# EAGLE design hacker-house-esp32-board (EAGLE 9.3.0)

## Sheet 1 of 7
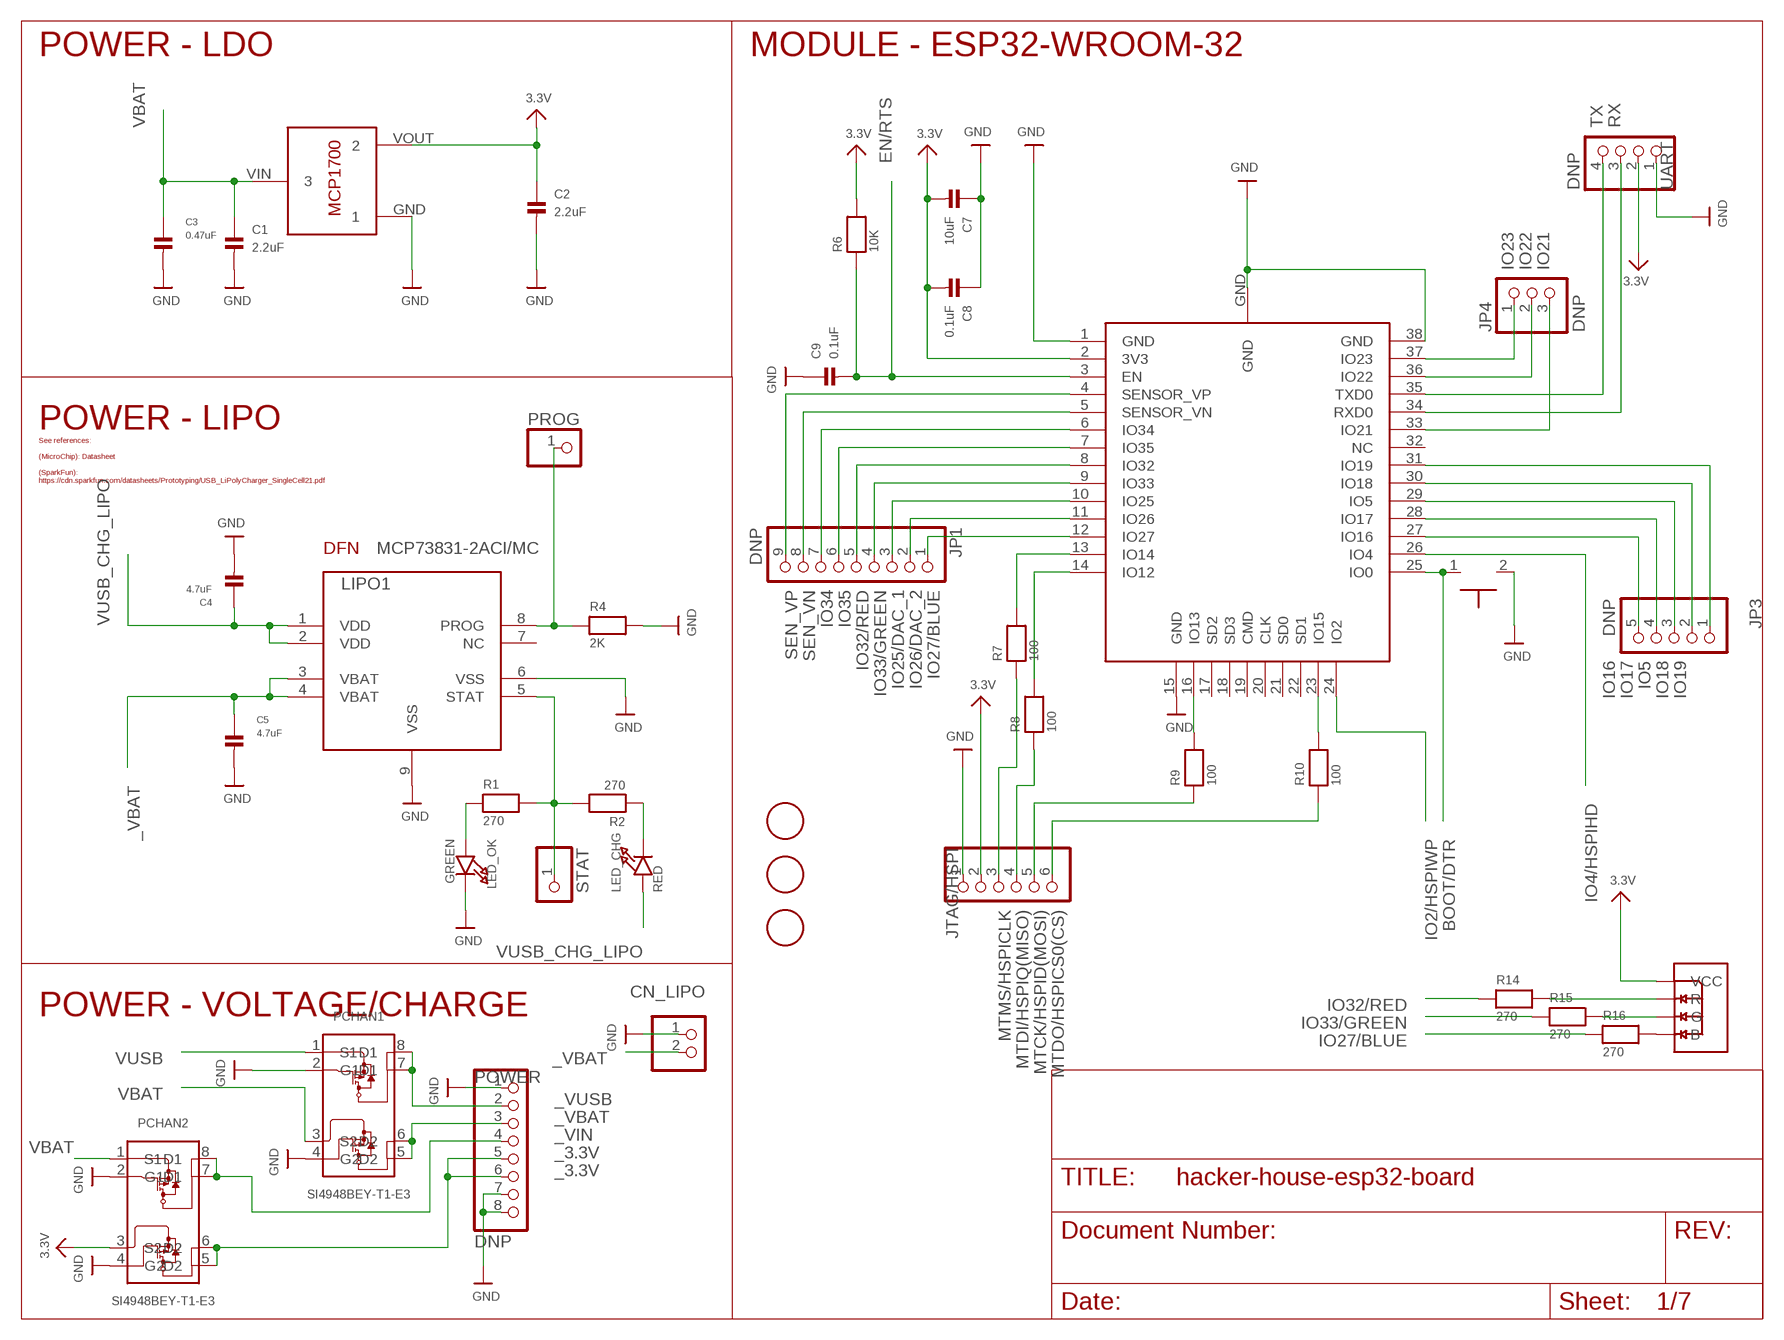
[diagram p0: schematic, sheet 1]

### Parts
BOOT  TACTILE_SWITCH_NO_GND_NO_BOSS  [SIDE_ACT_NO_GND_NO_BOSS]
C1  2.2uF  CAP_CERAMIC_0402MP  [_0402MP]
C2  2.2uF  CAP_CERAMIC_0402MP  [_0402MP]
C3  0.47uF  CAP_CERAMIC_0402MP  [_0402MP]
C4  4.7uF  CAP_CERAMIC_0402MP  [_0402MP]
C5  4.7uF  CAP_CERAMIC_0402MP  [_0402MP]
C7  10uF  CAP_CERAMIC_0603MP  [_0603MP]
C8  0.1uF  CAP_CERAMIC_0402MP  [_0402MP]
C9  0.1uF  CAP_CERAMIC_0402MP  [_0402MP]
CN_LIPO  JST_2PIN  [JSTPH2]
FID1  FIDUCIAL  [FIDUCIAL_1MM]
FID2  FIDUCIAL  [FIDUCIAL_1MM]
FID3  FIDUCIAL  [FIDUCIAL_1MM]
JP1  DNP  PINHD-1X9  [1X09]
JP3  DNP  PINHD-1X5  [1X05]
JP4  DNP  PINHD-1X3  [1X03]
JTAG/HSPI  HEADER-1X6ROUND  [1X06_ROUND]
LDO1  3.3V  MCP1700T-3302E/TT  [MCP1700T-3302E/TT]
LED_CHG  RED  LED0603_NOOUTLINE  [CHIPLED_0603_NOOUTLINE]
LED_OK  GREEN  LED0603_NOOUTLINE  [CHIPLED_0603_NOOUTLINE]
LIPO1  MCP73831-2ACI/MC  [2X3_DFN]
MOD1  ESP32-WROOM-32  [ESP32-WROOM-32-MODULE]
PCHAN1  SI4948BEY-T1-E3  [SO-8]
PCHAN2  SI4948BEY-T1-E3  [SO-8]
POWER  DNP  HEADER-1X8  [1X08_OVAL]
PROG  HEADER-1X1ROUND  [1X01_ROUND]
R1  270  RESISTOR_0402MP  [_0402MP]
R2  270  RESISTOR_0402MP  [_0402MP]
R4  2K  RESISTOR_0402MP  [_0402MP]
R6  10K  RESISTOR_0402MP  [_0402MP]
R7  100  RESISTOR_0402MP  [_0402MP]
R8  100  RESISTOR_0402MP  [_0402MP]
R9  100  RESISTOR_0402MP  [_0402MP]
R10  100  RESISTOR_0402MP  [_0402MP]
R14  270  RESISTOR_0402MP  [_0402MP]
R15  270  RESISTOR_0402MP  [_0402MP]
R16  270  RESISTOR_0402MP  [_0402MP]
RGB1  LRTB_R48G  [LRTB_R48G]
STAT  HEADER-1X1ROUND  [1X01_ROUND]
UART  DNP  HEADER-1X4ROUND  [1X04_ROUND]

### Nets
3.3V: C2.1 C7.2 C8.2 JTAG/HSPI.2 LDO1.VOUT MOD1.2(3V3) PCHAN2.3(S2) R6.2 RGB1.1(VCC) UART.2 ; also sheet 2
_3.3V: PCHAN2.5(D2) PCHAN2.6(D2) POWER.5 POWER.6
_VBAT: C5.1 CN_LIPO.2 LIPO1.3(VBAT) LIPO1.4(VBAT) PCHAN1.5(D2) PCHAN1.6(D2) POWER.3
_VIN: PCHAN2.7(D1) PCHAN2.8(D1) POWER.4
_VUSB: PCHAN1.7(D1) PCHAN1.8(D1) POWER.2 ; also sheet 2
BOOT/DTR: BOOT.1 MOD1.25(IO0) ; also sheet 2
EN/RTS: C9.2 MOD1.3(EN) R6.1 ; also sheet 2
GND_UNMASKED: BOOT.2 C1.2 C2.2 C3.2 C4.2 C5.2 C7.1 C8.1 C9.1 CN_LIPO.1 JTAG/HSPI.1 LDO1.GND LED_OK.C LIPO1.6(VSS) LIPO1.9(VSS) MOD1.1(GND) MOD1.15(GND) MOD1.38(GND) MOD1.GND PCHAN1.2(G1) PCHAN1.4(G2) PCHAN2.2(G1) PCHAN2.4(G2) POWER.1 POWER.7 POWER.8 R4.2 UART.1 ; supply symbol labelled GND ; also sheet 2
IO2/HSPIWP: MOD1.24(IO2)
IO4/HSPIHD: MOD1.26(IO4)
IO5: JP3.3 MOD1.29(IO5)
IO16: JP3.5 MOD1.27(IO16)
IO17: JP3.4 MOD1.28(IO17)
IO18: JP3.2 MOD1.30(IO18)
IO19: JP3.1 MOD1.31(IO19)
IO21: JP4.3 MOD1.33(IO21)
IO22: JP4.2 MOD1.36(IO22)
IO23: JP4.1 MOD1.37(IO23)
IO25/DAC_1: JP1.3 MOD1.10(IO25)
IO26/DAC_2: JP1.2 MOD1.11(IO26)
IO27/BLUE: JP1.1 MOD1.12(IO27) R16.1
IO32/RED: JP1.5 MOD1.8(IO32) R14.1
IO33/GREEN: JP1.4 MOD1.9(IO33) R15.1
IO34: JP1.7 MOD1.6(IO34)
IO35: JP1.6 MOD1.7(IO35)
MTCK/HSPID(MOSI): JTAG/HSPI.5 R9.1
MTDI/HSPIQ(MISO): JTAG/HSPI.4 R8.1
MTDI_: MOD1.14(IO12) R8.2
MTDO/HSPICS0(CS): JTAG/HSPI.6 R10.1
MTMS/HSPICLK: JTAG/HSPI.3 R7.1
N$6: R16.2 RGB1.4(B)
N$7: MOD1.13(IO14) R7.2
N$8: R15.2 RGB1.3(G)
N$9: LED_OK.A R1.1
N$10: LED_CHG.C R2.1
N$11: R14.2 RGB1.2(R)
N$18: MOD1.16(IO13) R9.2
N$19: MOD1.23(IO15) R10.2
PROG: LIPO1.8(PROG) PROG.1 R4.1
RX: MOD1.34(RXD0) UART.3 ; also sheet 2
SEN_VN: JP1.8 MOD1.5(SENSOR_VN)
SEN_VP: JP1.9 MOD1.4(SENSOR_VP)
STAT: LIPO1.5(STAT) R1.2 R2.2 STAT.1
TX: MOD1.35(TXD0) UART.4 ; also sheet 2
VBAT: C1.1 C3.1 LDO1.VIN PCHAN1.3(S2) PCHAN2.1(S1)
VUSB: PCHAN1.1(S1) ; also sheet 2
VUSB_CHG_LIPO: C4.1 LED_CHG.A LIPO1.1(VDD) LIPO1.2(VDD) ; also sheet 2
Unconnected: LIPO1.7(NC) MOD1.17(SD2) MOD1.18(SD3) MOD1.19(CMD) MOD1.20(CLK) MOD1.21(SD0) MOD1.22(SD1) MOD1.32(NC)

### Notes on the sheet
- POWER - LDO | MODULE - ESP32-WROOM-32
- POWER - LIPO
- See references:
  
  (MicroChip): Datasheet
  
  (SparkFun): 
  https://cdn.sparkfun.com/datasheets/Prototyping/USB_LiPolyCharger_SingleCell21.pdf
- POWER - VOLTAGE/CHARGE

## Sheet 2 of 7
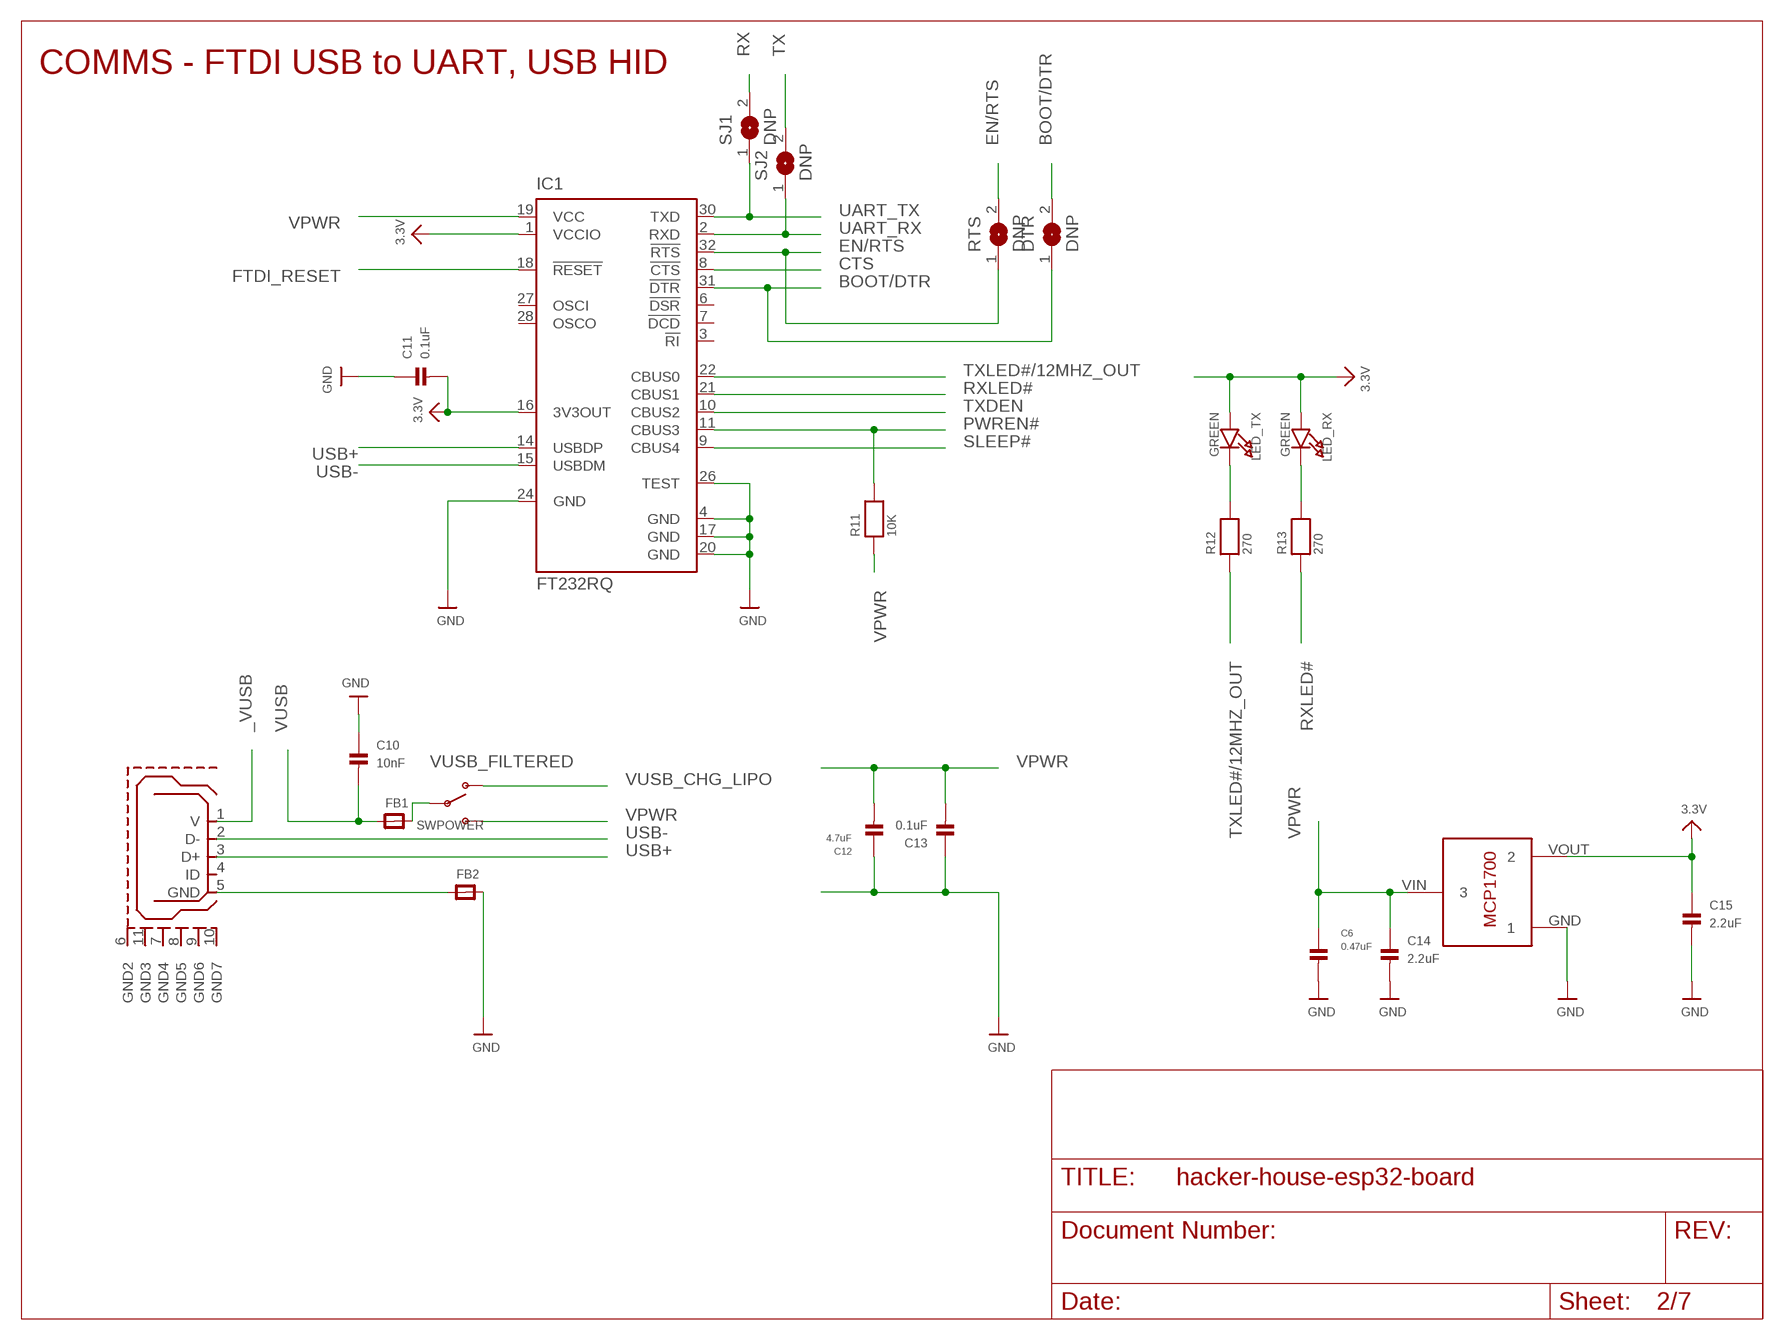
[diagram p1: schematic, sheet 2]

### Parts
C6  0.47uF  CAP_CERAMIC_0402MP  [_0402MP]
C10  10nF  CAP_CERAMIC_0402MP  [_0402MP]
C11  0.1uF  CAP_CERAMIC_0402MP  [_0402MP]
C12  4.7uF  CAP_CERAMIC_0402MP  [_0402MP]
C13  0.1uF  CAP_CERAMIC_0402MP  [_0402MP]
C14  2.2uF  CAP_CERAMIC_0402MP  [_0402MP]
C15  2.2uF  CAP_CERAMIC_0402MP  [_0402MP]
DTR  DNP  SOLDERJUMPERCLOSED  [SOLDERJUMPER_CLOSEDWIRE]
FB1  FERRITE_0603MP  [_0603MP]
FB2  FERRITE_0603MP  [_0603MP]
IC1  FT232RQ  [QFN32]
LDO2  3.3V  MCP1700T-3302E/TT  [MCP1700T-3302E/TT]
LED_RX  GREEN  LED0603_NOOUTLINE  [CHIPLED_0603_NOOUTLINE]
LED_TX  GREEN  LED0603_NOOUTLINE  [CHIPLED_0603_NOOUTLINE]
R11  10K  RESISTOR_0402MP  [_0402MP]
R12  270  RESISTOR_0402MP  [_0402MP]
R13  270  RESISTOR_0402MP  [_0402MP]
RTS  DNP  SOLDERJUMPERCLOSED  [SOLDERJUMPER_CLOSEDWIRE]
SJ1  DNP  SOLDERJUMPERCLOSED  [SOLDERJUMPER_CLOSEDWIRE]
SJ2  DNP  SOLDERJUMPERCLOSED  [SOLDERJUMPER_CLOSEDWIRE]
SWPOWER  SWITCH_SPDT  [SPDT_SMT_SSSS811101]
U$14  USB_MICROB  [USB_MICROB_PACKAGE]

### Nets
3.3V: C11.2 C15.1 IC1.1(VCCIO) IC1.16(3V3OUT) LDO2.VOUT LED_RX.A LED_TX.A ; also sheet 1
_VUSB: U$14.1(V) ; also sheet 1
BOOT/DTR: DTR.1 DTR.2 IC1.31(!DTR) ; also sheet 1
CTS: IC1.8(!CTS)
EN/RTS: IC1.32(!RTS) RTS.1 RTS.2 ; also sheet 1
FTDI_RESET: IC1.18(!RESET)
GND_UNMASKED: C6.2 C10.1 C11.1 C12.1 C13.1 C14.2 C15.2 FB2.2 IC1.4(GND) IC1.17(GND) IC1.20(GND) IC1.24(GND) IC1.26(TEST) LDO2.GND ; supply symbol labelled GND ; also sheet 1
N$2: FB2.1 U$14.5(GND)
N$4: LED_TX.C R12.2
N$5: LED_RX.C R13.2
PWREN#: IC1.11(CBUS3) R11.2
RX: SJ1.2 ; also sheet 1
RXLED#: IC1.21(CBUS1) R13.1
SLEEP#: IC1.9(CBUS4)
TX: SJ2.2 ; also sheet 1
TXDEN: IC1.10(CBUS2)
TXLED#/12MHZ_OUT: IC1.22(CBUS0) R12.1
UART_RX: IC1.2(RXD) SJ2.1
UART_TX: IC1.30(TXD) SJ1.1
USB+: IC1.14(USBDP) U$14.3(D+)
USB-: IC1.15(USBDM) U$14.2(D-)
VPWR: C6.1 C12.2 C13.2 C14.1 IC1.19(VCC) LDO2.VIN R11.1 SWPOWER.C(S)
VUSB: C10.2 FB1.1 ; also sheet 1
VUSB_CHG_LIPO: SWPOWER.A(O) ; also sheet 1
VUSB_FILTERED: FB1.2 SWPOWER.B(P)
Unconnected: IC1.3(!RI) IC1.6(!DSR) IC1.7(!DCD) IC1.27(OSCI) IC1.28(OSCO) U$14.4(ID) U$14.6(GND2) U$14.7(GND4) U$14.8(GND5) U$14.9(GND6) U$14.10(GND7) U$14.11(GND3)

### Notes on the sheet
- COMMS - FTDI USB to UART, USB HID

## Sheet 3 of 7
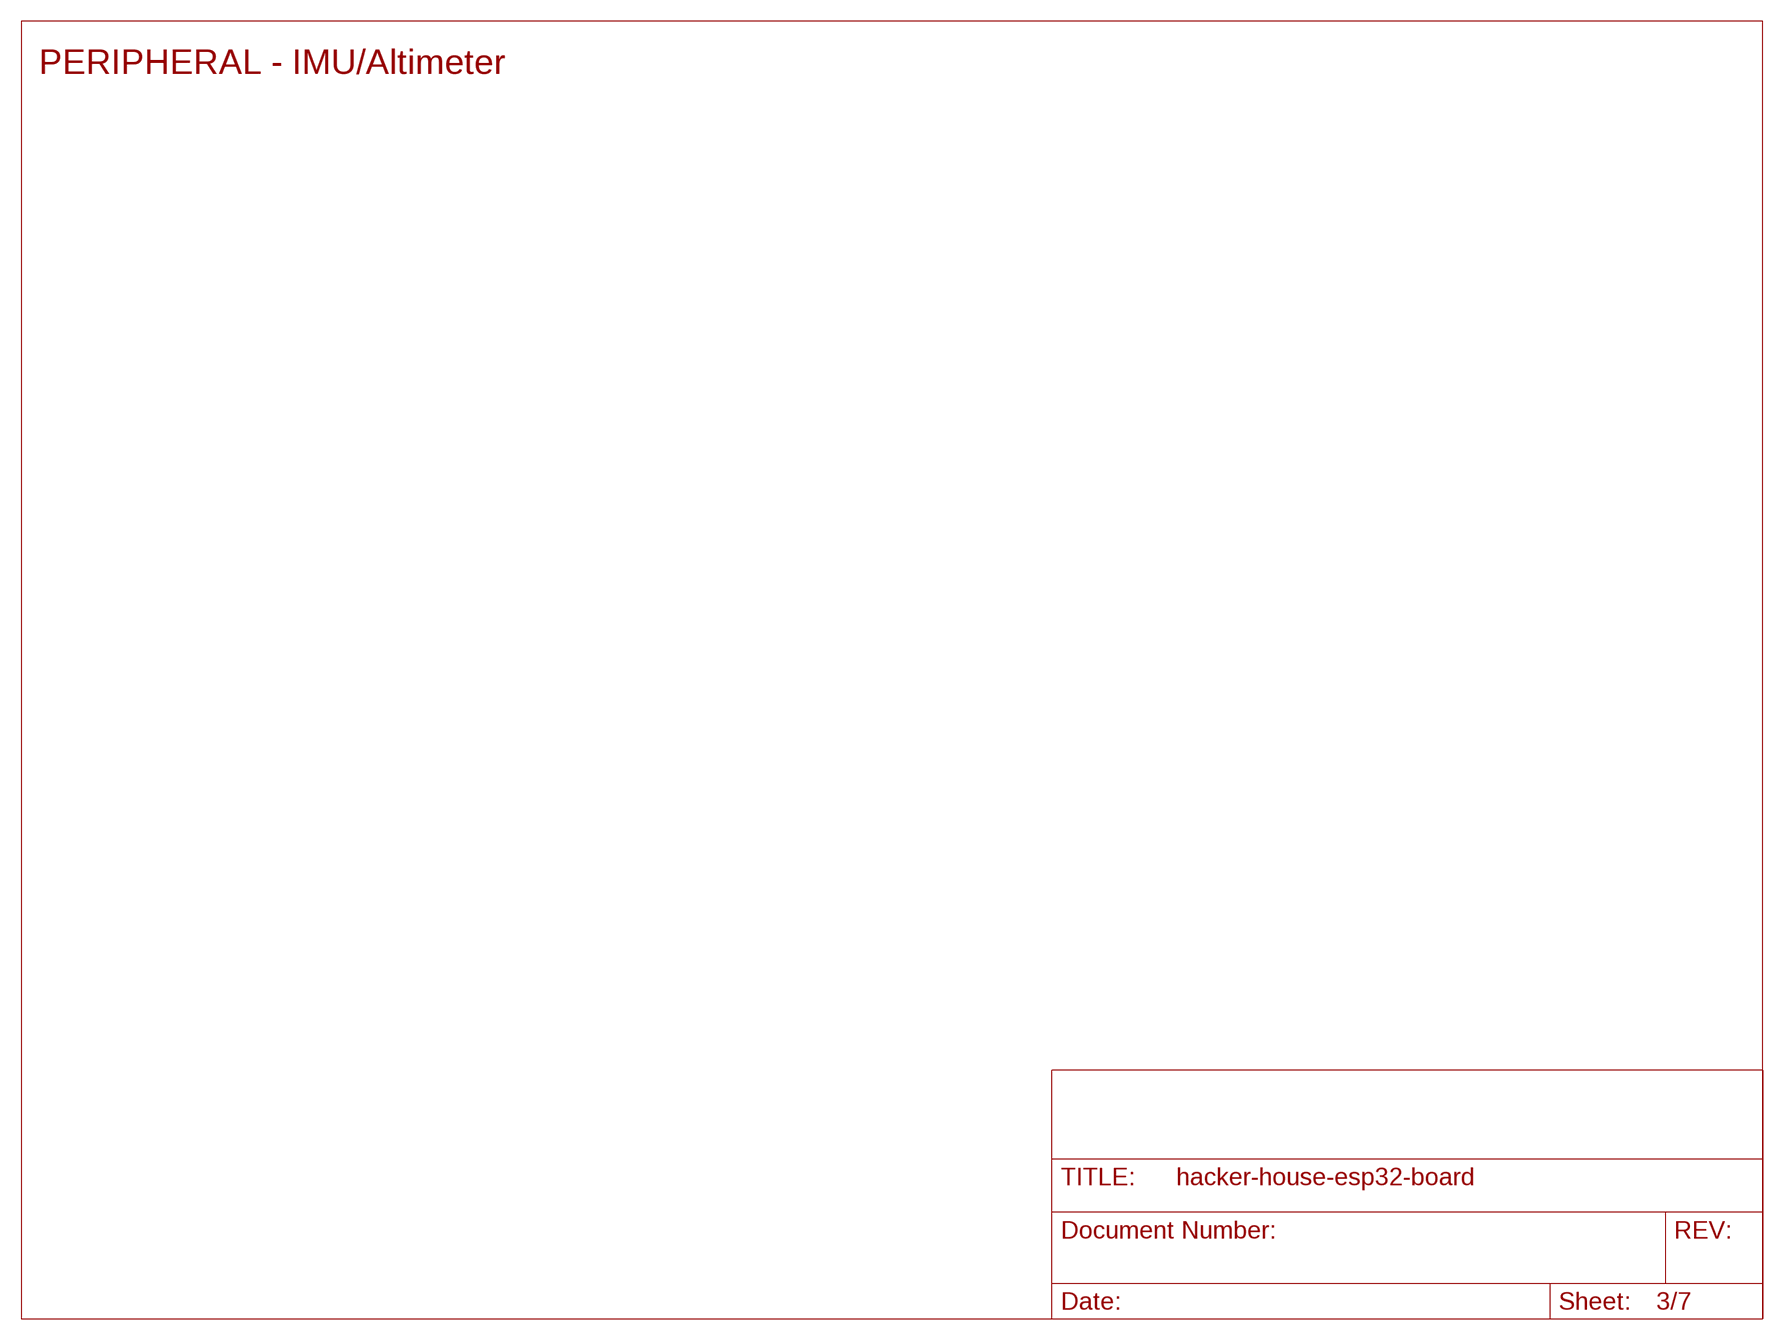
[diagram p2: schematic, sheet 3]

### Notes on the sheet
- PERIPHERAL - IMU/Altimeter

## Sheet 4 of 7
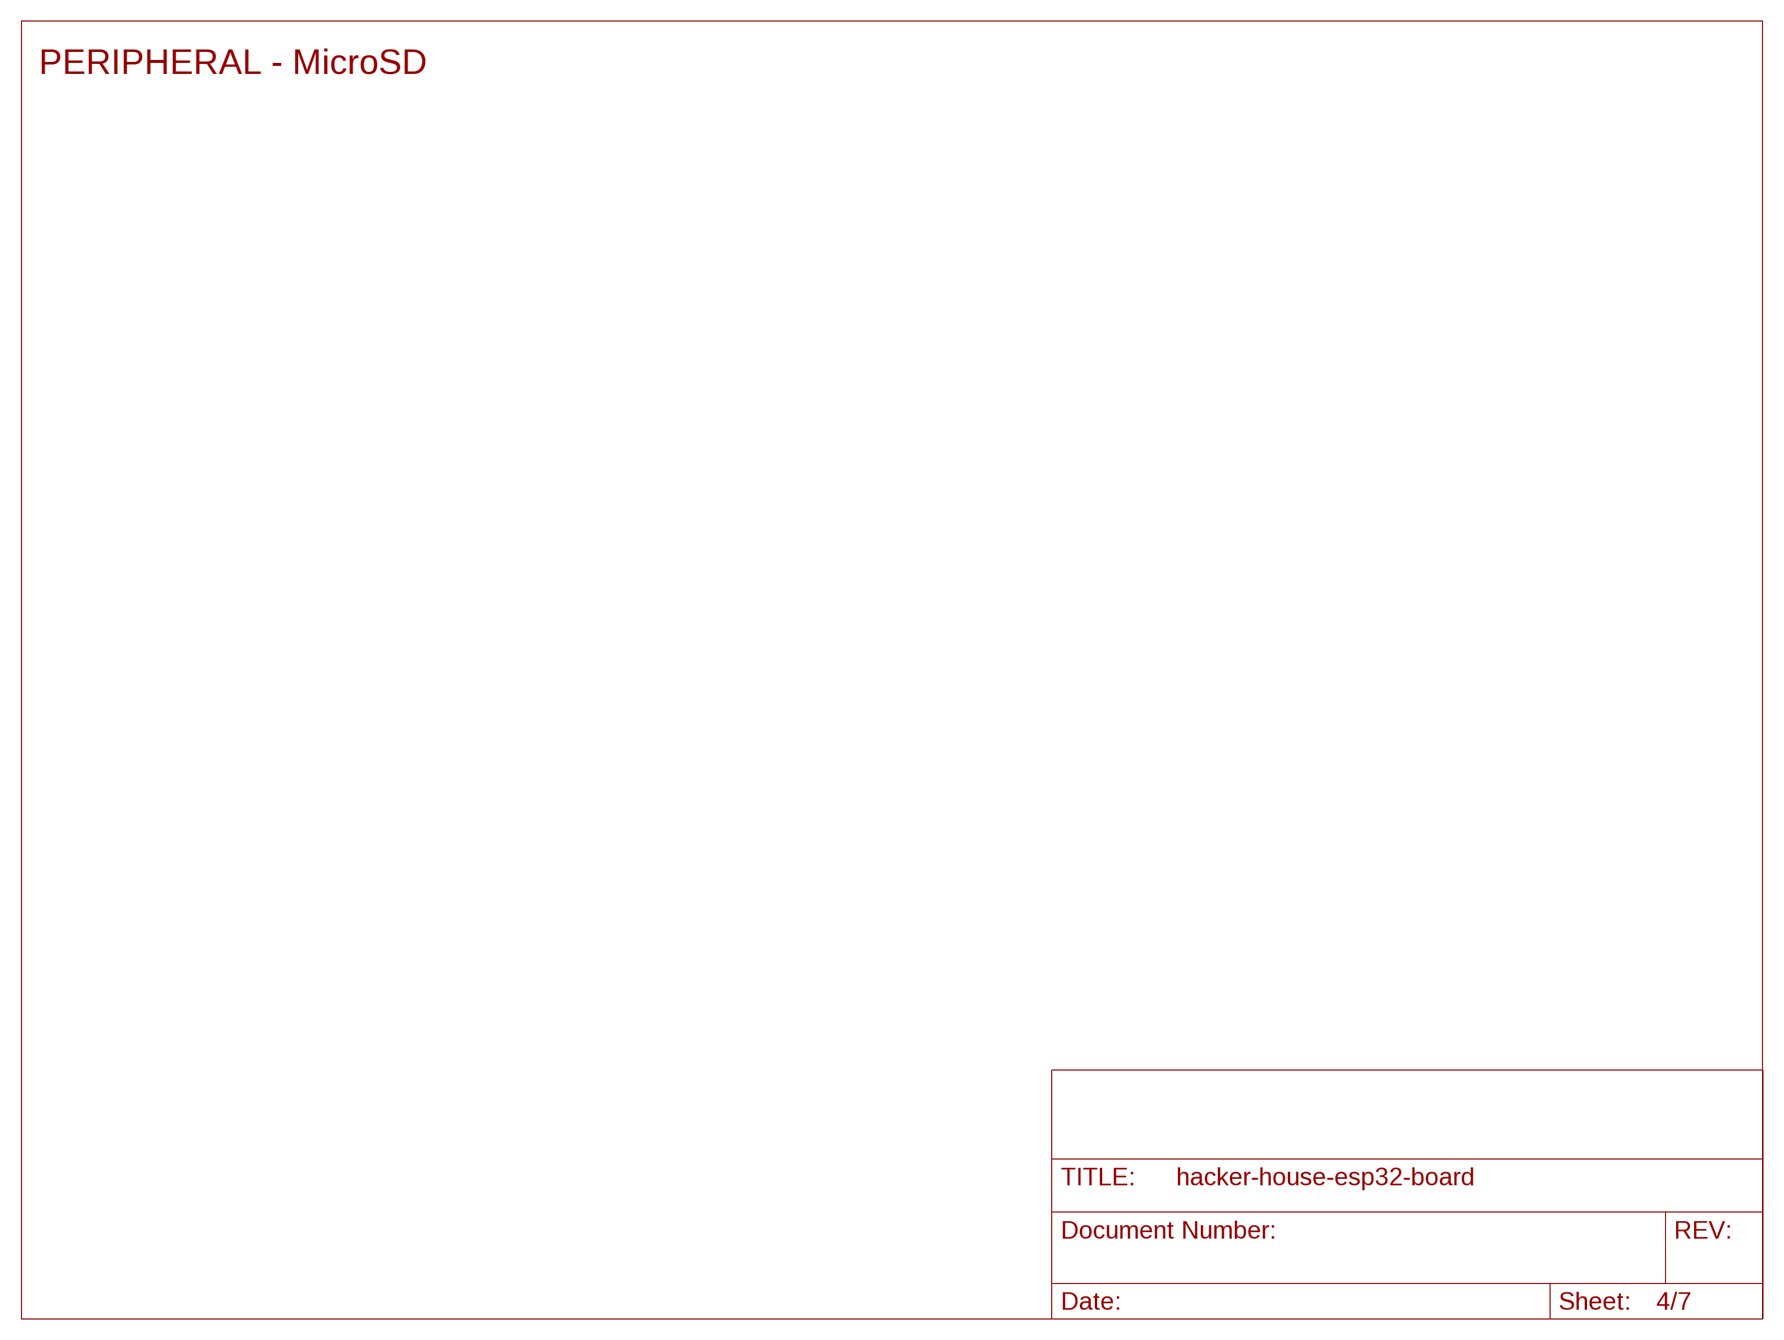
[diagram p3: schematic, sheet 4]

### Notes on the sheet
- PERIPHERAL - MicroSD

## Sheet 5 of 7
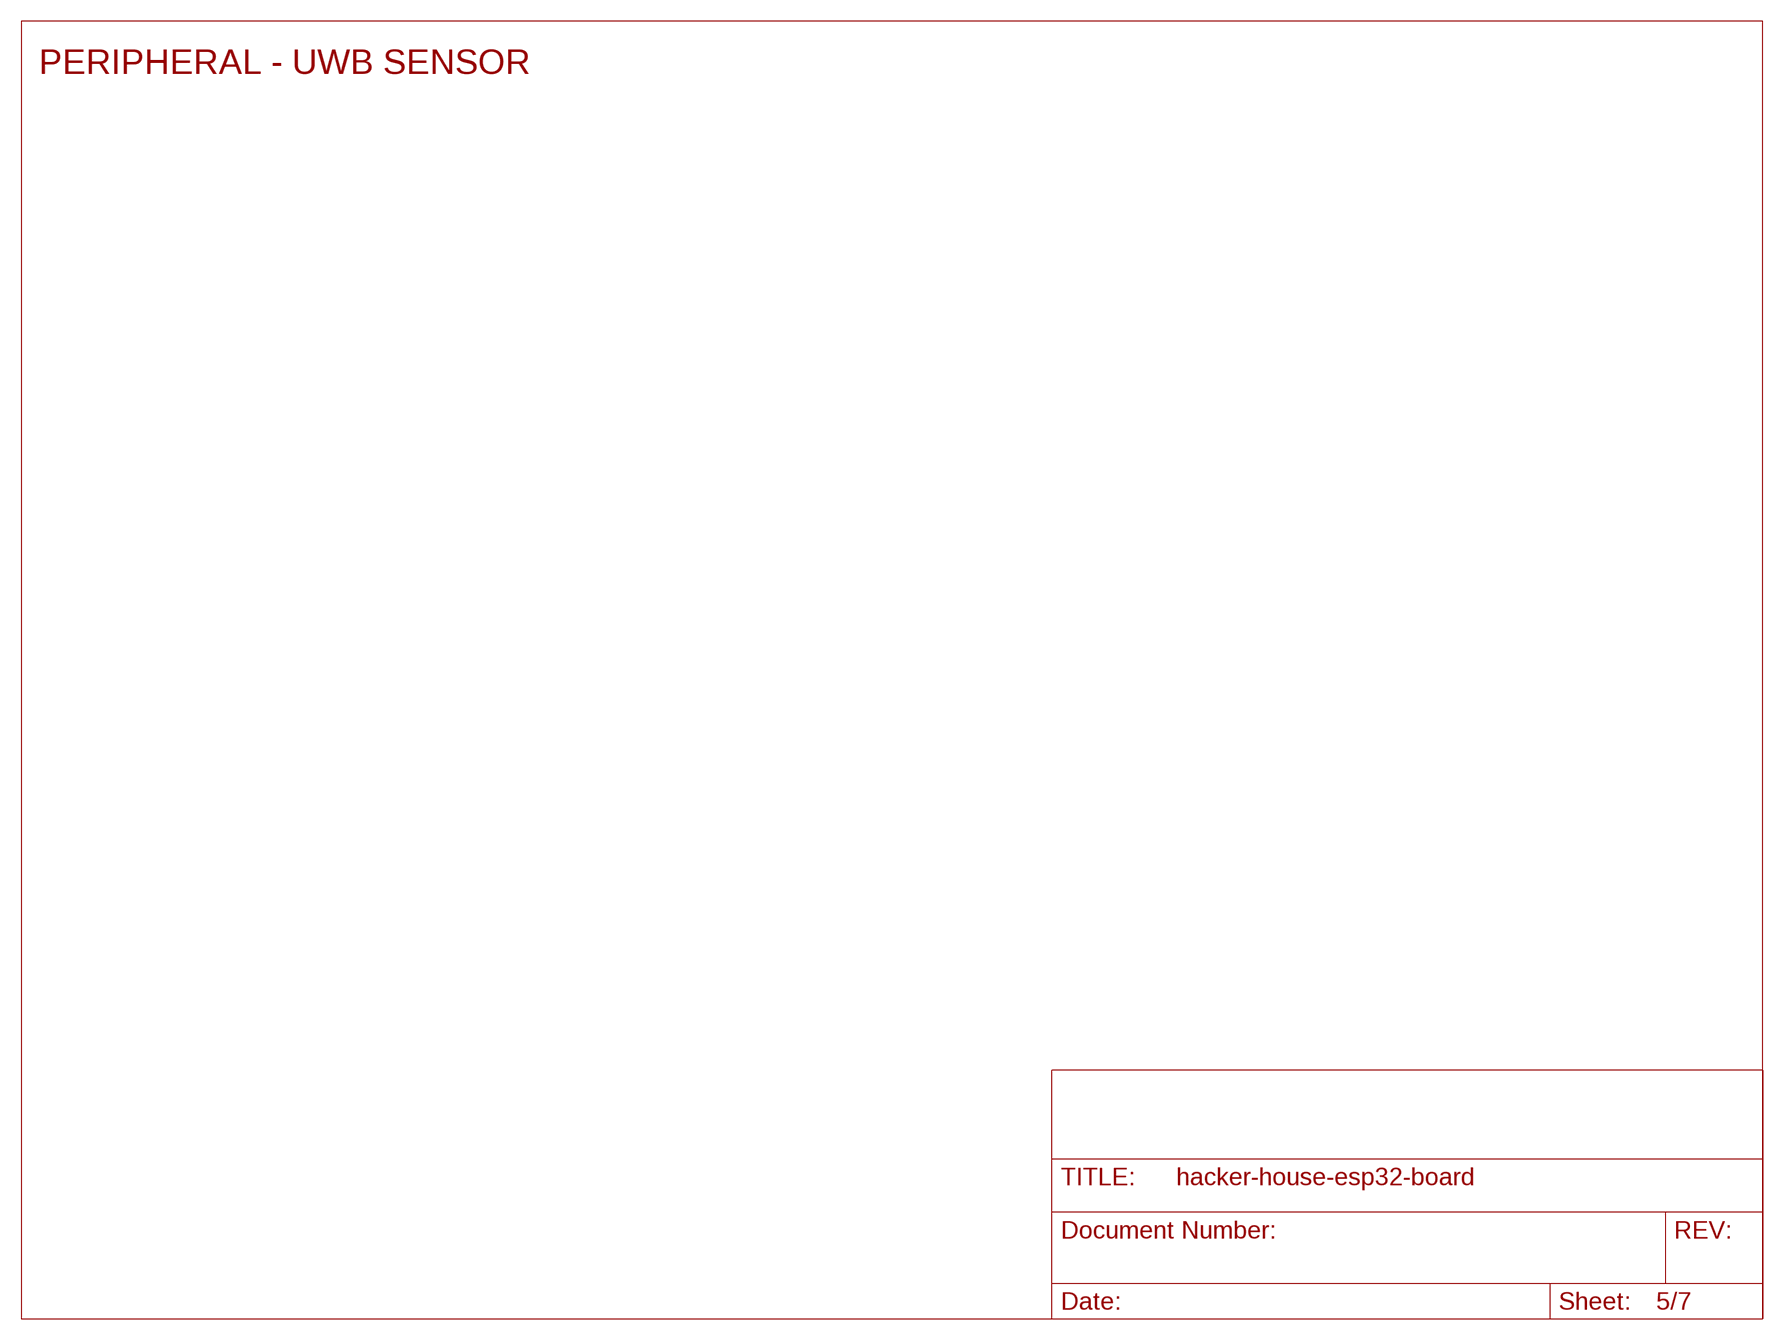
[diagram p4: schematic, sheet 5]

### Notes on the sheet
- PERIPHERAL - UWB SENSOR

## Sheet 6 of 7
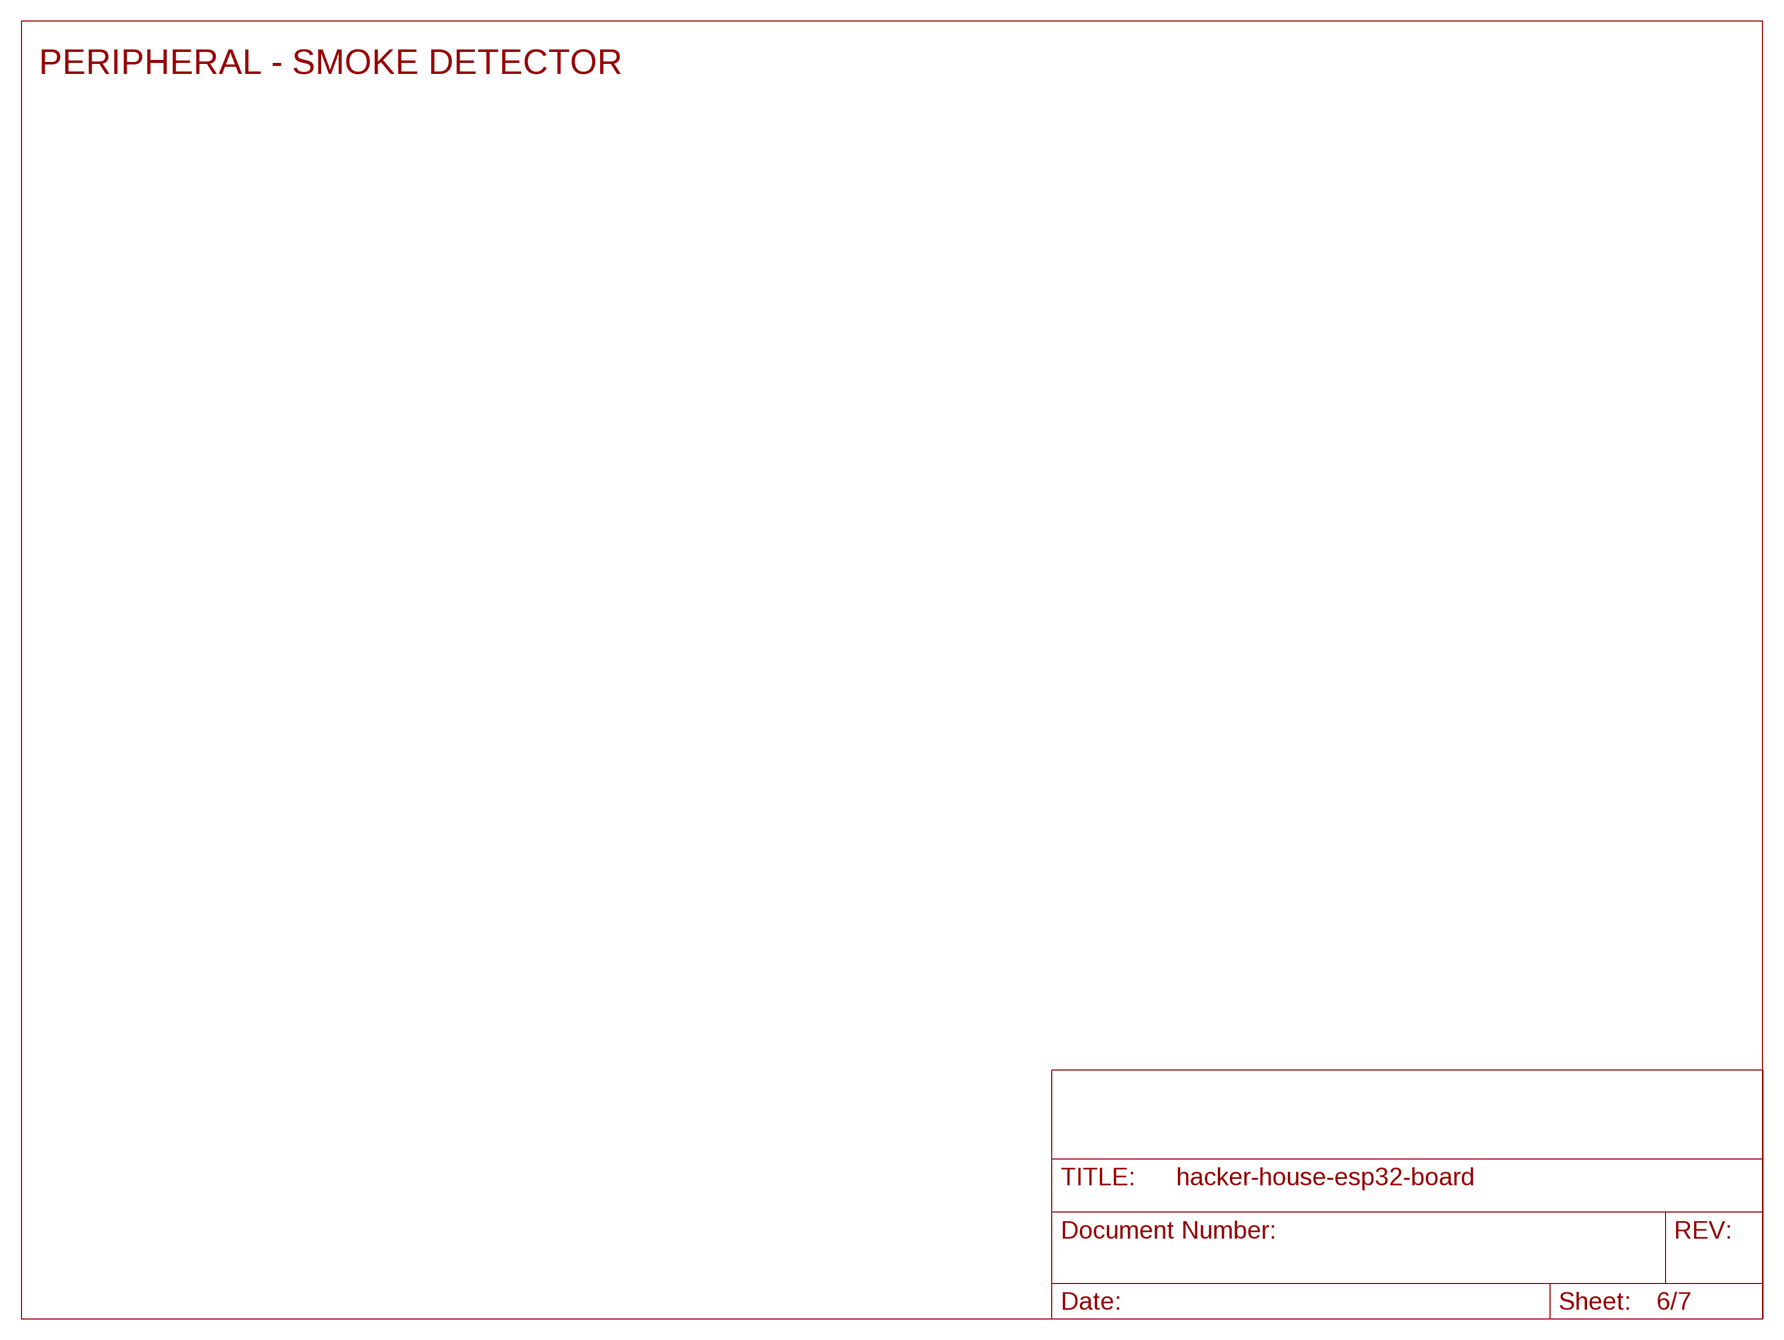
[diagram p5: schematic, sheet 6]

### Notes on the sheet
- PERIPHERAL - SMOKE DETECTOR

## Sheet 7 of 7
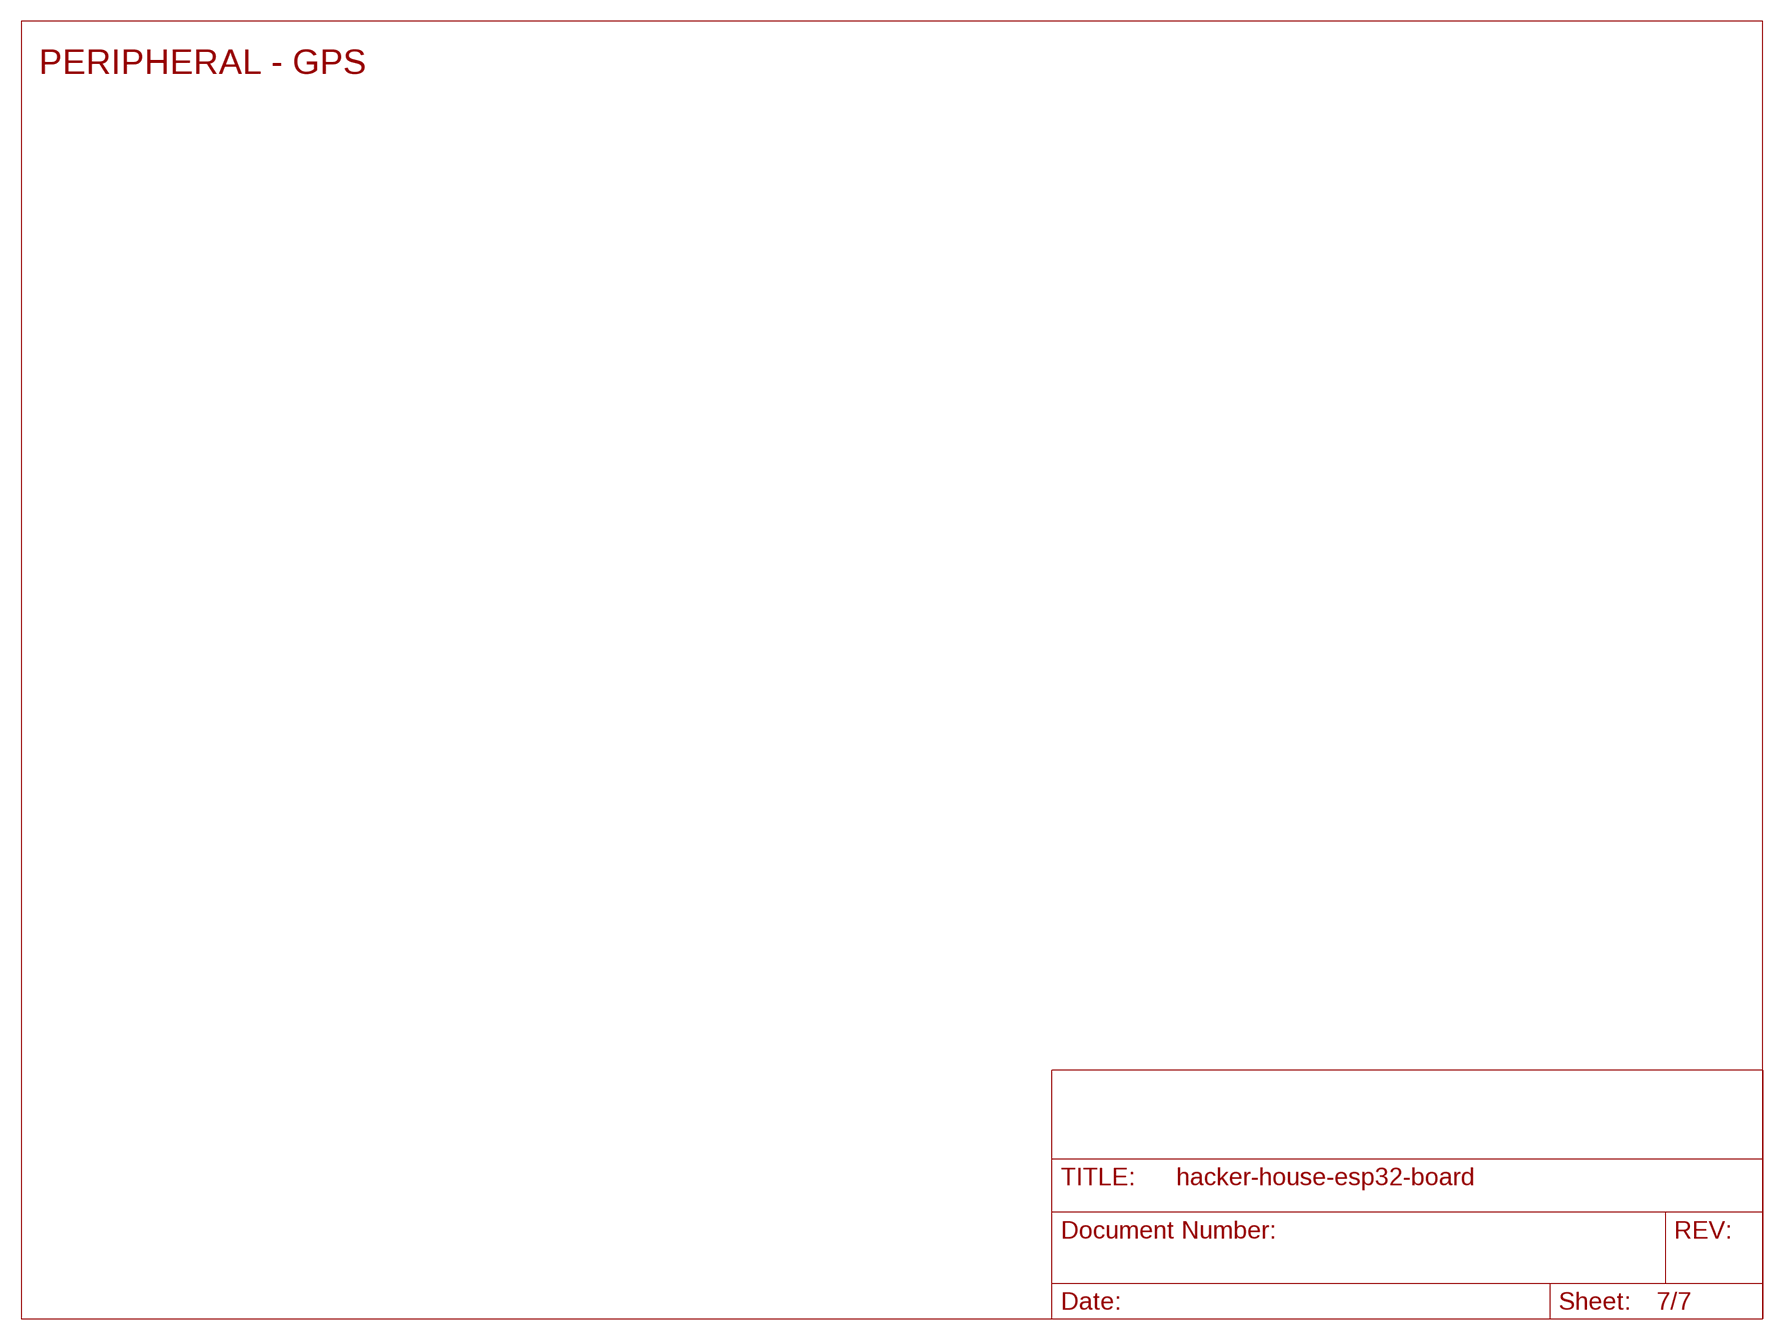
[diagram p6: schematic, sheet 7]

### Notes on the sheet
- PERIPHERAL - GPS

## Library data of the parts
BOOT = omron_tactile_switch:TACTILE_SWITCH_NO_GND_NO_BOSS: Omron tactile switch; MPN: B3U-3000P
C1 C2 C14 C15 = microbuilder:CAP_CERAMIC: Ceramic Capacitors 0402 - 0402 Surface Mount Capacitors 16pF 50V 5% [Digikey: 445-4899-2-ND] 18pF 50V 5% [Digikey: 490-1281-2-ND] 22pF 50V 5% [Digikey: 490-1283-2-ND] 68pF 50V 5% [Digikey: 490-1289-2-ND] 0.1uF 10V 10% [Digikey: 490-1318-2-ND] 1.0uF 6.3V 10% [Digikey: 490-1320-2-ND] 0603 - 0603 Surface Mount Capacitors 16 pF 50V 5% [Digikey: 445-5051-2-ND] 22 pF 50V [Digikey: PCC220ACVTR-ND] 33 pF 50V 5% [Digikey: 490-1415-1-ND] 56pF 50V 5% [Digikey: 490-1421-1-ND] 220pF 50V 5% [Digikey: 445-1285-1-ND] 680 pF 50V 2200 pF 50V 5% C0G [Digikey: 445-1297-1-ND] 5600 pF 100V 5% X7R [Digikey: 478-3711-1-ND] 0.1 µF 25V 10% [Digikey: PCC2277TR-ND] 0.22 µF 16V 10% X7R [Digikey: 445-1318-1-ND] 1.0 µF 25V 10% [Digikey: 445-5146-2-ND] 0603 - RF Specific 3pF 250V +/-0.1pF RF [Digikey: 712-1347-1-ND] 18 pF 250V 5% [Digikey: 478-3505-1-ND or 712-1322-1-ND] 56 pF 250V 5% C0G RF [Digikey: 490-4867-1-ND] 68 pF 250V RF [Digikey: 490-4868-1-ND] 0805 - 0805 Surface Mount Capacitors 220 pF 250V 2% RF Ceramic Capacitor [Digikey: 712-1398-1-ND] 1000 pF 50V 2% NP0 Ceramic Capacitor [Digikey: 478-3760-1-ND] 0.1 µF 25V 10% Ceramic Capacitor [Digikey: PCC1828TR-ND] 1.0 µF 16V 10% Ceramic Capacitor[Digikey: 490-1691-2-ND] 10.0 µF 10V 10% Ceramic Capacitor[Digikey: 709-1228-1-ND] 10.0 uF 16V 10% Ceramic Capacitor [Digikey: 478-5165-2-ND] 47 uF 6.3V 20% Ceramic Capacitor [Digikey: 587-1779-1-ND or 399-5506-1-ND] 1206 - 1206 Surface Mount Capacitors 47uF 10V 20% Ceramic Capacitor [Digikey: 490-5528-1-ND or 399-5508-1-ND or 445-6010-1-ND] 100uF 6.3V -20%, +80% Y5V Ceramic Capacitor (Digikey: 490-4512-1-ND, Mouser: 81-GRM31CF50J107ZE1L); MPN: C1005X5R0J225K050BC
C3 C6 = microbuilder:CAP_CERAMIC: Ceramic Capacitors 0402 - 0402 Surface Mount Capacitors 16pF 50V 5% [Digikey: 445-4899-2-ND] 18pF 50V 5% [Digikey: 490-1281-2-ND] 22pF 50V 5% [Digikey: 490-1283-2-ND] 68pF 50V 5% [Digikey: 490-1289-2-ND] 0.1uF 10V 10% [Digikey: 490-1318-2-ND] 1.0uF 6.3V 10% [Digikey: 490-1320-2-ND] 0603 - 0603 Surface Mount Capacitors 16 pF 50V 5% [Digikey: 445-5051-2-ND] 22 pF 50V [Digikey: PCC220ACVTR-ND] 33 pF 50V 5% [Digikey: 490-1415-1-ND] 56pF 50V 5% [Digikey: 490-1421-1-ND] 220pF 50V 5% [Digikey: 445-1285-1-ND] 680 pF 50V 2200 pF 50V 5% C0G [Digikey: 445-1297-1-ND] 5600 pF 100V 5% X7R [Digikey: 478-3711-1-ND] 0.1 µF 25V 10% [Digikey: PCC2277TR-ND] 0.22 µF 16V 10% X7R [Digikey: 445-1318-1-ND] 1.0 µF 25V 10% [Digikey: 445-5146-2-ND] 0603 - RF Specific 3pF 250V +/-0.1pF RF [Digikey: 712-1347-1-ND] 18 pF 250V 5% [Digikey: 478-3505-1-ND or 712-1322-1-ND] 56 pF 250V 5% C0G RF [Digikey: 490-4867-1-ND] 68 pF 250V RF [Digikey: 490-4868-1-ND] 0805 - 0805 Surface Mount Capacitors 220 pF 250V 2% RF Ceramic Capacitor [Digikey: 712-1398-1-ND] 1000 pF 50V 2% NP0 Ceramic Capacitor [Digikey: 478-3760-1-ND] 0.1 µF 25V 10% Ceramic Capacitor [Digikey: PCC1828TR-ND] 1.0 µF 16V 10% Ceramic Capacitor[Digikey: 490-1691-2-ND] 10.0 µF 10V 10% Ceramic Capacitor[Digikey: 709-1228-1-ND] 10.0 uF 16V 10% Ceramic Capacitor [Digikey: 478-5165-2-ND] 47 uF 6.3V 20% Ceramic Capacitor [Digikey: 587-1779-1-ND or 399-5506-1-ND] 1206 - 1206 Surface Mount Capacitors 47uF 10V 20% Ceramic Capacitor [Digikey: 490-5528-1-ND or 399-5508-1-ND or 445-6010-1-ND] 100uF 6.3V -20%, +80% Y5V Ceramic Capacitor (Digikey: 490-4512-1-ND, Mouser: 81-GRM31CF50J107ZE1L); MPN: GRM155R60J474KE19D
C4 C5 C12 = microbuilder:CAP_CERAMIC: Ceramic Capacitors 0402 - 0402 Surface Mount Capacitors 16pF 50V 5% [Digikey: 445-4899-2-ND] 18pF 50V 5% [Digikey: 490-1281-2-ND] 22pF 50V 5% [Digikey: 490-1283-2-ND] 68pF 50V 5% [Digikey: 490-1289-2-ND] 0.1uF 10V 10% [Digikey: 490-1318-2-ND] 1.0uF 6.3V 10% [Digikey: 490-1320-2-ND] 0603 - 0603 Surface Mount Capacitors 16 pF 50V 5% [Digikey: 445-5051-2-ND] 22 pF 50V [Digikey: PCC220ACVTR-ND] 33 pF 50V 5% [Digikey: 490-1415-1-ND] 56pF 50V 5% [Digikey: 490-1421-1-ND] 220pF 50V 5% [Digikey: 445-1285-1-ND] 680 pF 50V 2200 pF 50V 5% C0G [Digikey: 445-1297-1-ND] 5600 pF 100V 5% X7R [Digikey: 478-3711-1-ND] 0.1 µF 25V 10% [Digikey: PCC2277TR-ND] 0.22 µF 16V 10% X7R [Digikey: 445-1318-1-ND] 1.0 µF 25V 10% [Digikey: 445-5146-2-ND] 0603 - RF Specific 3pF 250V +/-0.1pF RF [Digikey: 712-1347-1-ND] 18 pF 250V 5% [Digikey: 478-3505-1-ND or 712-1322-1-ND] 56 pF 250V 5% C0G RF [Digikey: 490-4867-1-ND] 68 pF 250V RF [Digikey: 490-4868-1-ND] 0805 - 0805 Surface Mount Capacitors 220 pF 250V 2% RF Ceramic Capacitor [Digikey: 712-1398-1-ND] 1000 pF 50V 2% NP0 Ceramic Capacitor [Digikey: 478-3760-1-ND] 0.1 µF 25V 10% Ceramic Capacitor [Digikey: PCC1828TR-ND] 1.0 µF 16V 10% Ceramic Capacitor[Digikey: 490-1691-2-ND] 10.0 µF 10V 10% Ceramic Capacitor[Digikey: 709-1228-1-ND] 10.0 uF 16V 10% Ceramic Capacitor [Digikey: 478-5165-2-ND] 47 uF 6.3V 20% Ceramic Capacitor [Digikey: 587-1779-1-ND or 399-5506-1-ND] 1206 - 1206 Surface Mount Capacitors 47uF 10V 20% Ceramic Capacitor [Digikey: 490-5528-1-ND or 399-5508-1-ND or 445-6010-1-ND] 100uF 6.3V -20%, +80% Y5V Ceramic Capacitor (Digikey: 490-4512-1-ND, Mouser: 81-GRM31CF50J107ZE1L); MPN: GRM155R60G475ME47D
C7 = microbuilder:CAP_CERAMIC: Ceramic Capacitors 0402 - 0402 Surface Mount Capacitors 16pF 50V 5% [Digikey: 445-4899-2-ND] 18pF 50V 5% [Digikey: 490-1281-2-ND] 22pF 50V 5% [Digikey: 490-1283-2-ND] 68pF 50V 5% [Digikey: 490-1289-2-ND] 0.1uF 10V 10% [Digikey: 490-1318-2-ND] 1.0uF 6.3V 10% [Digikey: 490-1320-2-ND] 0603 - 0603 Surface Mount Capacitors 16 pF 50V 5% [Digikey: 445-5051-2-ND] 22 pF 50V [Digikey: PCC220ACVTR-ND] 33 pF 50V 5% [Digikey: 490-1415-1-ND] 56pF 50V 5% [Digikey: 490-1421-1-ND] 220pF 50V 5% [Digikey: 445-1285-1-ND] 680 pF 50V 2200 pF 50V 5% C0G [Digikey: 445-1297-1-ND] 5600 pF 100V 5% X7R [Digikey: 478-3711-1-ND] 0.1 µF 25V 10% [Digikey: PCC2277TR-ND] 0.22 µF 16V 10% X7R [Digikey: 445-1318-1-ND] 1.0 µF 25V 10% [Digikey: 445-5146-2-ND] 0603 - RF Specific 3pF 250V +/-0.1pF RF [Digikey: 712-1347-1-ND] 18 pF 250V 5% [Digikey: 478-3505-1-ND or 712-1322-1-ND] 56 pF 250V 5% C0G RF [Digikey: 490-4867-1-ND] 68 pF 250V RF [Digikey: 490-4868-1-ND] 0805 - 0805 Surface Mount Capacitors 220 pF 250V 2% RF Ceramic Capacitor [Digikey: 712-1398-1-ND] 1000 pF 50V 2% NP0 Ceramic Capacitor [Digikey: 478-3760-1-ND] 0.1 µF 25V 10% Ceramic Capacitor [Digikey: PCC1828TR-ND] 1.0 µF 16V 10% Ceramic Capacitor[Digikey: 490-1691-2-ND] 10.0 µF 10V 10% Ceramic Capacitor[Digikey: 709-1228-1-ND] 10.0 uF 16V 10% Ceramic Capacitor [Digikey: 478-5165-2-ND] 47 uF 6.3V 20% Ceramic Capacitor [Digikey: 587-1779-1-ND or 399-5506-1-ND] 1206 - 1206 Surface Mount Capacitors 47uF 10V 20% Ceramic Capacitor [Digikey: 490-5528-1-ND or 399-5508-1-ND or 445-6010-1-ND] 100uF 6.3V -20%, +80% Y5V Ceramic Capacitor (Digikey: 490-4512-1-ND, Mouser: 81-GRM31CF50J107ZE1L); MPN: C1608X5R1A106K080AC
C8 C9 C11 C13 = microbuilder:CAP_CERAMIC: Ceramic Capacitors 0402 - 0402 Surface Mount Capacitors 16pF 50V 5% [Digikey: 445-4899-2-ND] 18pF 50V 5% [Digikey: 490-1281-2-ND] 22pF 50V 5% [Digikey: 490-1283-2-ND] 68pF 50V 5% [Digikey: 490-1289-2-ND] 0.1uF 10V 10% [Digikey: 490-1318-2-ND] 1.0uF 6.3V 10% [Digikey: 490-1320-2-ND] 0603 - 0603 Surface Mount Capacitors 16 pF 50V 5% [Digikey: 445-5051-2-ND] 22 pF 50V [Digikey: PCC220ACVTR-ND] 33 pF 50V 5% [Digikey: 490-1415-1-ND] 56pF 50V 5% [Digikey: 490-1421-1-ND] 220pF 50V 5% [Digikey: 445-1285-1-ND] 680 pF 50V 2200 pF 50V 5% C0G [Digikey: 445-1297-1-ND] 5600 pF 100V 5% X7R [Digikey: 478-3711-1-ND] 0.1 µF 25V 10% [Digikey: PCC2277TR-ND] 0.22 µF 16V 10% X7R [Digikey: 445-1318-1-ND] 1.0 µF 25V 10% [Digikey: 445-5146-2-ND] 0603 - RF Specific 3pF 250V +/-0.1pF RF [Digikey: 712-1347-1-ND] 18 pF 250V 5% [Digikey: 478-3505-1-ND or 712-1322-1-ND] 56 pF 250V 5% C0G RF [Digikey: 490-4867-1-ND] 68 pF 250V RF [Digikey: 490-4868-1-ND] 0805 - 0805 Surface Mount Capacitors 220 pF 250V 2% RF Ceramic Capacitor [Digikey: 712-1398-1-ND] 1000 pF 50V 2% NP0 Ceramic Capacitor [Digikey: 478-3760-1-ND] 0.1 µF 25V 10% Ceramic Capacitor [Digikey: PCC1828TR-ND] 1.0 µF 16V 10% Ceramic Capacitor[Digikey: 490-1691-2-ND] 10.0 µF 10V 10% Ceramic Capacitor[Digikey: 709-1228-1-ND] 10.0 uF 16V 10% Ceramic Capacitor [Digikey: 478-5165-2-ND] 47 uF 6.3V 20% Ceramic Capacitor [Digikey: 587-1779-1-ND or 399-5506-1-ND] 1206 - 1206 Surface Mount Capacitors 47uF 10V 20% Ceramic Capacitor [Digikey: 490-5528-1-ND or 399-5508-1-ND or 445-6010-1-ND] 100uF 6.3V -20%, +80% Y5V Ceramic Capacitor (Digikey: 490-4512-1-ND, Mouser: 81-GRM31CF50J107ZE1L); MPN: CC0402KRX7R6BB104
C10 = microbuilder:CAP_CERAMIC: Ceramic Capacitors 0402 - 0402 Surface Mount Capacitors 16pF 50V 5% [Digikey: 445-4899-2-ND] 18pF 50V 5% [Digikey: 490-1281-2-ND] 22pF 50V 5% [Digikey: 490-1283-2-ND] 68pF 50V 5% [Digikey: 490-1289-2-ND] 0.1uF 10V 10% [Digikey: 490-1318-2-ND] 1.0uF 6.3V 10% [Digikey: 490-1320-2-ND] 0603 - 0603 Surface Mount Capacitors 16 pF 50V 5% [Digikey: 445-5051-2-ND] 22 pF 50V [Digikey: PCC220ACVTR-ND] 33 pF 50V 5% [Digikey: 490-1415-1-ND] 56pF 50V 5% [Digikey: 490-1421-1-ND] 220pF 50V 5% [Digikey: 445-1285-1-ND] 680 pF 50V 2200 pF 50V 5% C0G [Digikey: 445-1297-1-ND] 5600 pF 100V 5% X7R [Digikey: 478-3711-1-ND] 0.1 µF 25V 10% [Digikey: PCC2277TR-ND] 0.22 µF 16V 10% X7R [Digikey: 445-1318-1-ND] 1.0 µF 25V 10% [Digikey: 445-5146-2-ND] 0603 - RF Specific 3pF 250V +/-0.1pF RF [Digikey: 712-1347-1-ND] 18 pF 250V 5% [Digikey: 478-3505-1-ND or 712-1322-1-ND] 56 pF 250V 5% C0G RF [Digikey: 490-4867-1-ND] 68 pF 250V RF [Digikey: 490-4868-1-ND] 0805 - 0805 Surface Mount Capacitors 220 pF 250V 2% RF Ceramic Capacitor [Digikey: 712-1398-1-ND] 1000 pF 50V 2% NP0 Ceramic Capacitor [Digikey: 478-3760-1-ND] 0.1 µF 25V 10% Ceramic Capacitor [Digikey: PCC1828TR-ND] 1.0 µF 16V 10% Ceramic Capacitor[Digikey: 490-1691-2-ND] 10.0 µF 10V 10% Ceramic Capacitor[Digikey: 709-1228-1-ND] 10.0 uF 16V 10% Ceramic Capacitor [Digikey: 478-5165-2-ND] 47 uF 6.3V 20% Ceramic Capacitor [Digikey: 587-1779-1-ND or 399-5506-1-ND] 1206 - 1206 Surface Mount Capacitors 47uF 10V 20% Ceramic Capacitor [Digikey: 490-5528-1-ND or 399-5508-1-ND or 445-6010-1-ND] 100uF 6.3V -20%, +80% Y5V Ceramic Capacitor (Digikey: 490-4512-1-ND, Mouser: 81-GRM31CF50J107ZE1L); MPN: GRM155R71E103KA01D
CN_LIPO = microbuilder:JST_2PIN: JST 2-Pin Right-Angle Connector PH-Series - 4UConnector: 17311 SH-Series - 4UConnector: 07278; MPN: S2B-PH-SM4-TB(LF)(SN)
DTR RTS SJ1 SJ2 = microbuilder:SOLDERJUMPER: SMD Solder JUMPER Solder the two pads together to create a connection, or remove the solder to break it. REFLOW - Use this footprint for solder paste and reflow ovens. WAVE - Use this footprint for hand-soldering (larger pads). CLOSED - Has a trace between the two pads to ensure it is closed by default. The trace needs to be cut to disable the jumper, and can be closed again by creating a solder bridge between the two pads.
FB1 FB2 = microbuilder:FERRITE: Ferrite Bead 0603 MMZ1608B121C - 120 Ohm @ 100MHz, 600mA, 0.15 Ohm DC Resistance - Digikey: 445-2164-1-ND BK1608HW121-T - 120 Ohm, 600mA Ferrite Chip - Digikey: 587-1876-2-ND 0805 HZ0805B272R-10 - 2.7K Ohm @ 100MHz, 200mA, 0.8 Ohm DC Resistance - Digikey: 240-2504-1-ND (see also Murata BLM21BD272SN1L) MMZ2012Y152B - 1.5K Ohm @ 100MHz, 500mA, 0.4 Ohm DC Resistance - Digikey: 445-1560-1-ND - Mainly for high frequency (80-400MHz) MMZ2012R102A - 1K Ohm @ 100MHz, 500mA, 0.3 Ohm DC Resistance - Digikey: 445-1555-2-ND - More general purpose (10-200MHz); MPN: BLM18RK102SN1D
FID1-FID3 = adafruit:FIDUCIAL: For use by pick and place machines to calibrate the vision/machine, 1mm By microbuilder.eu
IC1 = ftdichip:FT232R: Source: http://www.ftdichip.com/Documents/DataSheets/DS_FT232R_v104.pdf; MPN: FT232RQ-REEL; OC_FARNELL: 1146033; OC_NEWARK: 91K9919
JP1 = pinhead:PINHD-1X9: PIN HEADER
JP3 = pinhead:PINHD-1X5: PIN HEADER
JP4 = pinhead:PINHD-1X3: PIN HEADER
JTAG/HSPI = microbuilder:HEADER-1X6: PIN HEADER
LDO1 LDO2 = MCP1700T-3302E_TT:MCP1700T-3302E/TT: Microchip LDO "MCP1700" in a 3-Pin SOT-23 package. ID: MCP1700T-3302E/TT; MPN: MCP1700T-3302E/TT
LED_CHG = microbuilder:LED: LED 0603 - 0603 Surface Mount Package 2mA: Green LED - Low Power (3.9mcd, 2ma, 1.7Vf) - Digikey: 475-2709-2-ND Orange LED - Low Power (9.8mcd, 2ma, 1.8Vf) - Digikey: 475-1194-2-ND Red LED - Low Power (5mcd, 2ma, 1.8Vf) - Digikey: 475-1195-2-ND Yellow LED - Low Power (7mcd, 2ma, 1.8Vf) - Digikey: 475-1196-2-ND 5mA: Blue LED - Low Power (17mcd, 5ma, 2.9Vf) - Digikey: LNJ937W8CRACT-ND 0805 - 0805 Surface Mount Package 2mA: Red LED (8.8mcd, 2mA, 1.8Vf, Clear) - Low Power [Digikey: 475-2510-1-ND] Green LED (5mcd, 2mA, 1.8Vf, Clear) - Low Power [Digikey: 475-2730-1-ND] Yellow LED (11.3mcd, 2mA, 1.8Vf, Clear) - Low Power [Digikey: 475-2555-1-ND] 20mA: Red LED (104mcd, 20mA, Diffused) - LS R976 [Digikey: 475-1278-6-ND] Red LED (12mcd, 20mA, 2.0Vf, Clear) - APT2012EC [Digikey: 754-1128-1-ND] Green LED (15mcd, 20mA, 2.2Vf, Clear) - APT2012GC [Digikey: 754-1131-1-ND] Orange LED (160mcd, 20mA, 2.1Vf, Clear) - APT2012SECK [Digikey: 754-1130-1-ND] 1206 - 1206 Surface Mount Package Green LED (26mcd, 20mA, Diffused) - LG N971 [Digikey: 475-1407-6-ND] Red LED (15mcd, 20mA, Diffused) - LH N974 [Digikey: 475-1416-6-ND]; MPN: 350-2029-1-ND
LED_OK LED_RX LED_TX = microbuilder:LED: LED 0603 - 0603 Surface Mount Package 2mA: Green LED - Low Power (3.9mcd, 2ma, 1.7Vf) - Digikey: 475-2709-2-ND Orange LED - Low Power (9.8mcd, 2ma, 1.8Vf) - Digikey: 475-1194-2-ND Red LED - Low Power (5mcd, 2ma, 1.8Vf) - Digikey: 475-1195-2-ND Yellow LED - Low Power (7mcd, 2ma, 1.8Vf) - Digikey: 475-1196-2-ND 5mA: Blue LED - Low Power (17mcd, 5ma, 2.9Vf) - Digikey: LNJ937W8CRACT-ND 0805 - 0805 Surface Mount Package 2mA: Red LED (8.8mcd, 2mA, 1.8Vf, Clear) - Low Power [Digikey: 475-2510-1-ND] Green LED (5mcd, 2mA, 1.8Vf, Clear) - Low Power [Digikey: 475-2730-1-ND] Yellow LED (11.3mcd, 2mA, 1.8Vf, Clear) - Low Power [Digikey: 475-2555-1-ND] 20mA: Red LED (104mcd, 20mA, Diffused) - LS R976 [Digikey: 475-1278-6-ND] Red LED (12mcd, 20mA, 2.0Vf, Clear) - APT2012EC [Digikey: 754-1128-1-ND] Green LED (15mcd, 20mA, 2.2Vf, Clear) - APT2012GC [Digikey: 754-1131-1-ND] Orange LED (160mcd, 20mA, 2.1Vf, Clear) - APT2012SECK [Digikey: 754-1130-1-ND] 1206 - 1206 Surface Mount Package Green LED (26mcd, 20mA, Diffused) - LG N971 [Digikey: 475-1407-6-ND] Red LED (15mcd, 20mA, Diffused) - LH N974 [Digikey: 475-1416-6-ND]; MPN: 350-2035-1-ND
LIPO1 = LiPO_MCP73831_2:MCP73831-2ACI/MC; MPN: MCP73831-2ACI/MC
MOD1 = esp32-wroom-32-managed:ESP32-WROOM-32: ESP32 WiFi/Bluetooth module; MPN: ESP32-WROOM-32D (16MB)
PCHAN1 PCHAN2 = vishay_mosfet:SI4948BEY-T1-E3: Vishay dual P-Channel Mosfet SI4948BEY-T1-E3; MPN: SI4948BEY-T1-E3
POWER = microbuilder:HEADER-1X8: PIN HEADER
PROG STAT = microbuilder:HEADER-1X1: PIN HEADER
R1 R2 R12-R16 = microbuilder:RESISTOR: Resistors 0402 - 0402 Surface Mount Package 22 Ohm 1% 1/16W [Digikey: 311-22.0LRTR-ND] 33 Ohm 5% 1/16W 1.0K 5% 1/16W 1.5K 5% 1/16W 2.0K 1% 1/16W 10.0K 1% 1/16W [Digikey: 311-10.0KLRTR-ND] 10.0K 5% 1/16W [Digikey: RMCF0402JT10K0TR-ND] 12.1K 1% 1/16W [Digikey: 311-22.0LRTR-ND] 100.0K 5% 1/16W 0603 - 0603 Surface Mount Package 0 Ohm 1/10 Watt 1% Resistor 15 Ohm 1/10 Watt 1% Resistor 33 Ohm 1/10 Watt 1% Resistor 49.9 Ohm 1/10 Watt 1% Resistor 100 Ohm 1/10 Watt 1% Resistor 150 Ohm 1/10 Watt 1% Resistor 240 Ohm 1/10 Watt 1% Resistor 390 Ohm 1/10 Watt 1% Resistor 560 Ohm 1/10 Watt 1% Resistor 680 Ohm 1/10 Watt 1% Resistor 750 Ohm 1/10 Watt 1% Resistor 1.0K Ohm 1/10 Watt 1% Resistor 1.5K Ohm 1/10 Watt 1% Resistor 2.0K Ohm 1/10 Watt 1% Resistor 2.2K Ohm 1/10 Watt 1% Resistor 3.3K Ohm 1/10 Watt 1% Resistor 4.7K Ohm 1/10 Watt 1% Resistor 10.0K Ohm 1/10 Watt 1% Resistor 12.0K Ohm 1/10 Watt 1% Resistor 12.1K Ohm 1/10 Watt 1% Resistor 20.0K Ohm 1/10 Watt 1% Resistor 33.0K Ohm 1/10 Watt 1% Resistor 100.0K Ohm 1/10 Watt 1% Resistor 0805 - 0805 Surface Mount Package 0 Ohm 1/8 Watt 1% Resistor 33 Ohm 1/8 Watt 1% Resistor 100 Ohm 1/8 Watt 1% Resistor 150 Ohm 1/8 Watt 1% Resistor 200 Ohm 1/8 Watt 1% Resistor 240 Ohm 1/8 Watt 1% Resistor 330 Ohm 1/8 Watt 1% Resistor 390 Ohm 1/8 Watt 1% Resistor 470 Ohm 1/8 Watt 1% Resistor 1.0K Ohm 1/8 Watt 1% Resistor 1.5K Ohm 1/8 Watt 1% Resistor 2.0K Ohm 1/8 Watt 1% Resistor 4.7K Ohm 1/8 Watt 1% Resistor 5.1K Ohm 1/8 Watt 1% Resistor 5.6K Ohm 1/8 Watt 1% Resistor 10.0K Ohm 1/8 Watt 1% Resistor 22.0K Ohm 1/8 Watt 1% Resistor 33.0K Ohm 1/8 Watt 1% Resistor 100K Ohm 1/8 Watt 1% Resistor 1206 - 1206 Surface Mount Package 2012 - 2010 Surface Mount Package 0.11 Ohm 1/2 Watt 1% Resistor - Digikey: RHM.11UCT-ND; MPN: CRCW0402270RFKED
R4 = microbuilder:RESISTOR: Resistors 0402 - 0402 Surface Mount Package 22 Ohm 1% 1/16W [Digikey: 311-22.0LRTR-ND] 33 Ohm 5% 1/16W 1.0K 5% 1/16W 1.5K 5% 1/16W 2.0K 1% 1/16W 10.0K 1% 1/16W [Digikey: 311-10.0KLRTR-ND] 10.0K 5% 1/16W [Digikey: RMCF0402JT10K0TR-ND] 12.1K 1% 1/16W [Digikey: 311-22.0LRTR-ND] 100.0K 5% 1/16W 0603 - 0603 Surface Mount Package 0 Ohm 1/10 Watt 1% Resistor 15 Ohm 1/10 Watt 1% Resistor 33 Ohm 1/10 Watt 1% Resistor 49.9 Ohm 1/10 Watt 1% Resistor 100 Ohm 1/10 Watt 1% Resistor 150 Ohm 1/10 Watt 1% Resistor 240 Ohm 1/10 Watt 1% Resistor 390 Ohm 1/10 Watt 1% Resistor 560 Ohm 1/10 Watt 1% Resistor 680 Ohm 1/10 Watt 1% Resistor 750 Ohm 1/10 Watt 1% Resistor 1.0K Ohm 1/10 Watt 1% Resistor 1.5K Ohm 1/10 Watt 1% Resistor 2.0K Ohm 1/10 Watt 1% Resistor 2.2K Ohm 1/10 Watt 1% Resistor 3.3K Ohm 1/10 Watt 1% Resistor 4.7K Ohm 1/10 Watt 1% Resistor 10.0K Ohm 1/10 Watt 1% Resistor 12.0K Ohm 1/10 Watt 1% Resistor 12.1K Ohm 1/10 Watt 1% Resistor 20.0K Ohm 1/10 Watt 1% Resistor 33.0K Ohm 1/10 Watt 1% Resistor 100.0K Ohm 1/10 Watt 1% Resistor 0805 - 0805 Surface Mount Package 0 Ohm 1/8 Watt 1% Resistor 33 Ohm 1/8 Watt 1% Resistor 100 Ohm 1/8 Watt 1% Resistor 150 Ohm 1/8 Watt 1% Resistor 200 Ohm 1/8 Watt 1% Resistor 240 Ohm 1/8 Watt 1% Resistor 330 Ohm 1/8 Watt 1% Resistor 390 Ohm 1/8 Watt 1% Resistor 470 Ohm 1/8 Watt 1% Resistor 1.0K Ohm 1/8 Watt 1% Resistor 1.5K Ohm 1/8 Watt 1% Resistor 2.0K Ohm 1/8 Watt 1% Resistor 4.7K Ohm 1/8 Watt 1% Resistor 5.1K Ohm 1/8 Watt 1% Resistor 5.6K Ohm 1/8 Watt 1% Resistor 10.0K Ohm 1/8 Watt 1% Resistor 22.0K Ohm 1/8 Watt 1% Resistor 33.0K Ohm 1/8 Watt 1% Resistor 100K Ohm 1/8 Watt 1% Resistor 1206 - 1206 Surface Mount Package 2012 - 2010 Surface Mount Package 0.11 Ohm 1/2 Watt 1% Resistor - Digikey: RHM.11UCT-ND; MPN: CPF0402B2K0E1
R6 R11 = microbuilder:RESISTOR: Resistors 0402 - 0402 Surface Mount Package 22 Ohm 1% 1/16W [Digikey: 311-22.0LRTR-ND] 33 Ohm 5% 1/16W 1.0K 5% 1/16W 1.5K 5% 1/16W 2.0K 1% 1/16W 10.0K 1% 1/16W [Digikey: 311-10.0KLRTR-ND] 10.0K 5% 1/16W [Digikey: RMCF0402JT10K0TR-ND] 12.1K 1% 1/16W [Digikey: 311-22.0LRTR-ND] 100.0K 5% 1/16W 0603 - 0603 Surface Mount Package 0 Ohm 1/10 Watt 1% Resistor 15 Ohm 1/10 Watt 1% Resistor 33 Ohm 1/10 Watt 1% Resistor 49.9 Ohm 1/10 Watt 1% Resistor 100 Ohm 1/10 Watt 1% Resistor 150 Ohm 1/10 Watt 1% Resistor 240 Ohm 1/10 Watt 1% Resistor 390 Ohm 1/10 Watt 1% Resistor 560 Ohm 1/10 Watt 1% Resistor 680 Ohm 1/10 Watt 1% Resistor 750 Ohm 1/10 Watt 1% Resistor 1.0K Ohm 1/10 Watt 1% Resistor 1.5K Ohm 1/10 Watt 1% Resistor 2.0K Ohm 1/10 Watt 1% Resistor 2.2K Ohm 1/10 Watt 1% Resistor 3.3K Ohm 1/10 Watt 1% Resistor 4.7K Ohm 1/10 Watt 1% Resistor 10.0K Ohm 1/10 Watt 1% Resistor 12.0K Ohm 1/10 Watt 1% Resistor 12.1K Ohm 1/10 Watt 1% Resistor 20.0K Ohm 1/10 Watt 1% Resistor 33.0K Ohm 1/10 Watt 1% Resistor 100.0K Ohm 1/10 Watt 1% Resistor 0805 - 0805 Surface Mount Package 0 Ohm 1/8 Watt 1% Resistor 33 Ohm 1/8 Watt 1% Resistor 100 Ohm 1/8 Watt 1% Resistor 150 Ohm 1/8 Watt 1% Resistor 200 Ohm 1/8 Watt 1% Resistor 240 Ohm 1/8 Watt 1% Resistor 330 Ohm 1/8 Watt 1% Resistor 390 Ohm 1/8 Watt 1% Resistor 470 Ohm 1/8 Watt 1% Resistor 1.0K Ohm 1/8 Watt 1% Resistor 1.5K Ohm 1/8 Watt 1% Resistor 2.0K Ohm 1/8 Watt 1% Resistor 4.7K Ohm 1/8 Watt 1% Resistor 5.1K Ohm 1/8 Watt 1% Resistor 5.6K Ohm 1/8 Watt 1% Resistor 10.0K Ohm 1/8 Watt 1% Resistor 22.0K Ohm 1/8 Watt 1% Resistor 33.0K Ohm 1/8 Watt 1% Resistor 100K Ohm 1/8 Watt 1% Resistor 1206 - 1206 Surface Mount Package 2012 - 2010 Surface Mount Package 0.11 Ohm 1/2 Watt 1% Resistor - Digikey: RHM.11UCT-ND; MPN: CRCW040210K0FKED
R7-R10 = microbuilder:RESISTOR: Resistors 0402 - 0402 Surface Mount Package 22 Ohm 1% 1/16W [Digikey: 311-22.0LRTR-ND] 33 Ohm 5% 1/16W 1.0K 5% 1/16W 1.5K 5% 1/16W 2.0K 1% 1/16W 10.0K 1% 1/16W [Digikey: 311-10.0KLRTR-ND] 10.0K 5% 1/16W [Digikey: RMCF0402JT10K0TR-ND] 12.1K 1% 1/16W [Digikey: 311-22.0LRTR-ND] 100.0K 5% 1/16W 0603 - 0603 Surface Mount Package 0 Ohm 1/10 Watt 1% Resistor 15 Ohm 1/10 Watt 1% Resistor 33 Ohm 1/10 Watt 1% Resistor 49.9 Ohm 1/10 Watt 1% Resistor 100 Ohm 1/10 Watt 1% Resistor 150 Ohm 1/10 Watt 1% Resistor 240 Ohm 1/10 Watt 1% Resistor 390 Ohm 1/10 Watt 1% Resistor 560 Ohm 1/10 Watt 1% Resistor 680 Ohm 1/10 Watt 1% Resistor 750 Ohm 1/10 Watt 1% Resistor 1.0K Ohm 1/10 Watt 1% Resistor 1.5K Ohm 1/10 Watt 1% Resistor 2.0K Ohm 1/10 Watt 1% Resistor 2.2K Ohm 1/10 Watt 1% Resistor 3.3K Ohm 1/10 Watt 1% Resistor 4.7K Ohm 1/10 Watt 1% Resistor 10.0K Ohm 1/10 Watt 1% Resistor 12.0K Ohm 1/10 Watt 1% Resistor 12.1K Ohm 1/10 Watt 1% Resistor 20.0K Ohm 1/10 Watt 1% Resistor 33.0K Ohm 1/10 Watt 1% Resistor 100.0K Ohm 1/10 Watt 1% Resistor 0805 - 0805 Surface Mount Package 0 Ohm 1/8 Watt 1% Resistor 33 Ohm 1/8 Watt 1% Resistor 100 Ohm 1/8 Watt 1% Resistor 150 Ohm 1/8 Watt 1% Resistor 200 Ohm 1/8 Watt 1% Resistor 240 Ohm 1/8 Watt 1% Resistor 330 Ohm 1/8 Watt 1% Resistor 390 Ohm 1/8 Watt 1% Resistor 470 Ohm 1/8 Watt 1% Resistor 1.0K Ohm 1/8 Watt 1% Resistor 1.5K Ohm 1/8 Watt 1% Resistor 2.0K Ohm 1/8 Watt 1% Resistor 4.7K Ohm 1/8 Watt 1% Resistor 5.1K Ohm 1/8 Watt 1% Resistor 5.6K Ohm 1/8 Watt 1% Resistor 10.0K Ohm 1/8 Watt 1% Resistor 22.0K Ohm 1/8 Watt 1% Resistor 33.0K Ohm 1/8 Watt 1% Resistor 100K Ohm 1/8 Watt 1% Resistor 1206 - 1206 Surface Mount Package 2012 - 2010 Surface Mount Package 0.11 Ohm 1/2 Watt 1% Resistor - Digikey: RHM.11UCT-ND; MPN: CPF0402B100RE1
RGB1 = osram_opto_LED:LRTB_R48G: OSRAM RGB LED; MPN: LRTB R48G
SWPOWER = microbuilder:SWITCH_SPDT: Switch - SPDT SSSS811101 - Horizontal Two Position SMT, 0.3A 4V [Mouser: 688-SSSS811101]; MPN: SSSS811101
U$14 = femtoduino:USB_MICROB: This is the hirose ZX62-B-5PA(11) MICRO-USB B Type female connection.; MPN: ZX62-B-5PA(33)
UART = microbuilder:HEADER-1X4: PIN HEADER

## Board
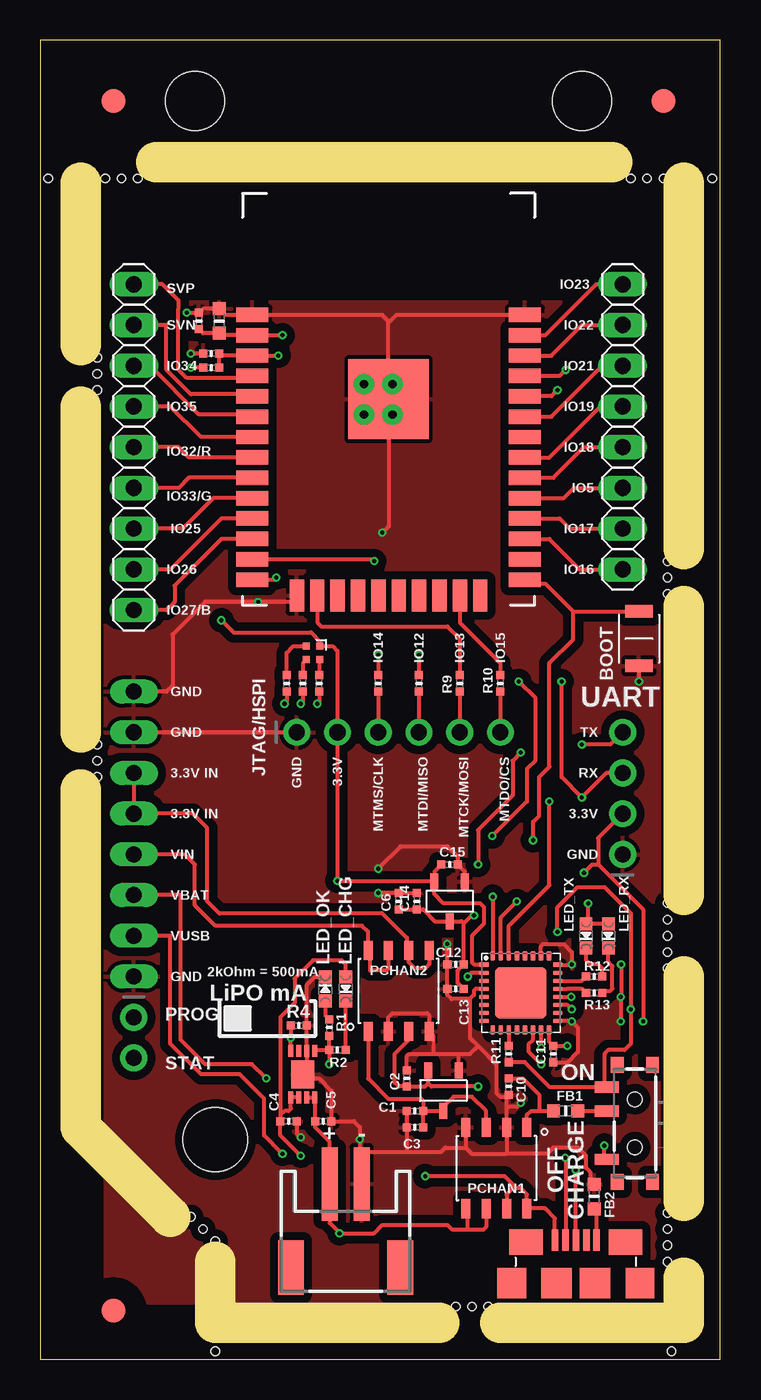
[diagram p7: board, top side]
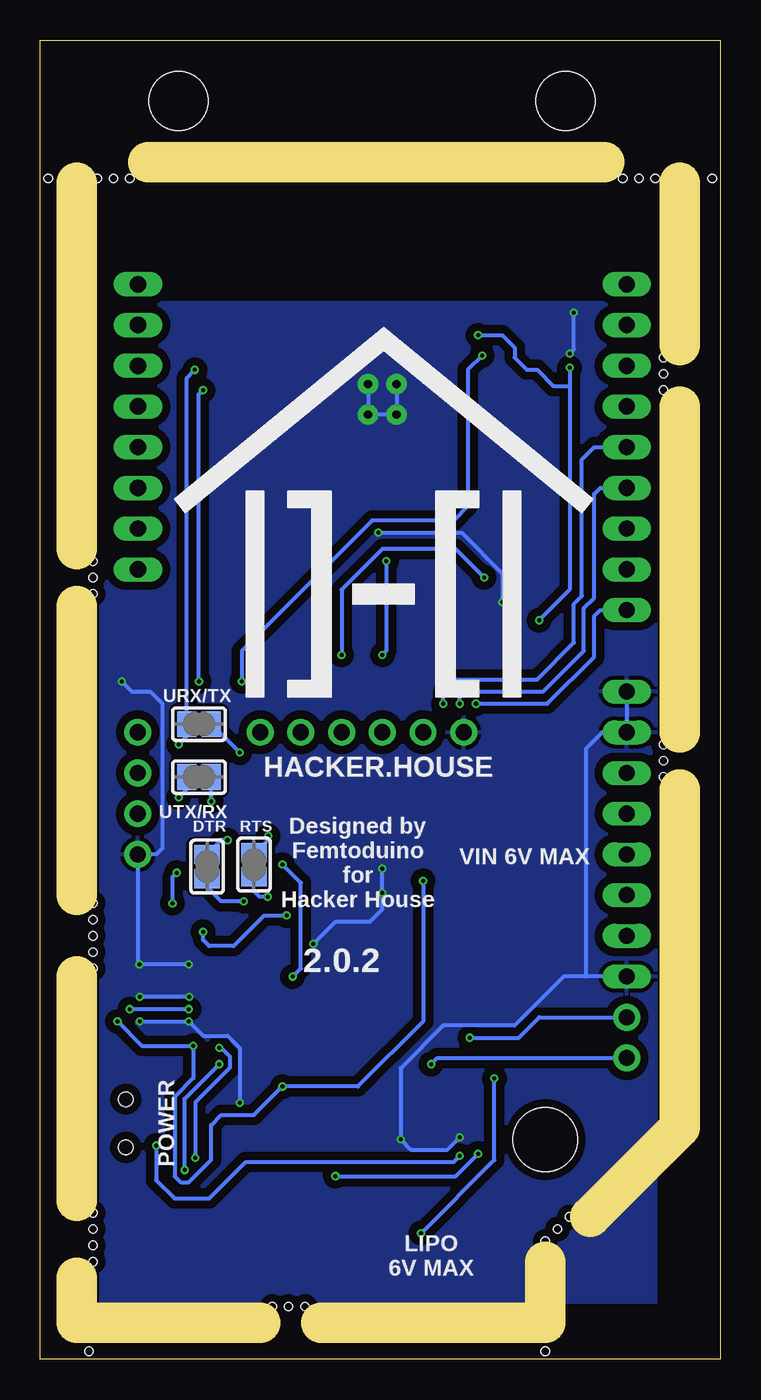
[diagram p8: board, bottom side, seen from below]

Size 42.42 x 82.29 mm. Coordinates in mm from the lower left corner, seen from the top.
Outline: 0,0 42.42,0 42.42,82.29 0,82.29 0,0
Copper layers (1*16): Top 0.035559375mm / dielectric 1.6mm / Bottom 0.035559375mm
Design rules "oshpark-2layer *": minimum track width 6mil, minimum drill 10mil, track to track 6mil, track to pad 6mil, pad to pad 6mil, via to via 6mil, smd to smd 6mil, copper to edge 15mil, drill to drill 6mil, minimum pad ring 5mil, minimum via ring 5mil, stop-mask expansion 2.5mil, vias tented up to drill 12mil, thermal gap 10mil
Holes 3.68 mm at 9.65,78.49 33.78,78.49
Holes 4 mm at 10.92,13.72
Holes 0.51 mm at 4.06,73.66 5.08,73.66 6.1,73.66 38.86,73.66 37.85,73.66 36.83,73.66 39.12,6.1 39.12,7.11 39.12,8.13 39.12,24.38 39.12,25.4 39.12,26.42 39.12,27.43 39.12,28.45 39.12,47.75 39.12,48.77 39.12,49.78 3.56,62.48 3.56,61.47 3.56,60.45 3.56,38.35 3.56,37.34 3.56,36.32 9.4,8.89 10.16,8.13 10.92,7.37 27.94,3.3 26.92,3.3 25.91,3.3 39.37,0.51 39.12,9.14 10.92,0.51 0.51,73.66 41.91,73.66
Milling: 12 lines

### Footprints (pad centres in the part's own frame; a part is rotated, then mirrored left to right if it is on the bottom)
SIDE_ACT_NO_GND_NO_BOSS = smd 0.8 x 1.7: 1 -1.7,0; 2 1.7,0
_0402MP = smd 0.5 x 0.5: 1 -0.508,0; 2 0.508,0
_0603MP = smd 0.8 x 0.8: 1 -0.762,0; 2 0.762,0
JSTPH2 = smd 1 x 4.6: 1 -1,-3.7; 2 1,-3.7 | smd 1.6 x 3.4: NC1 -3.4,1.5; NC2 3.4,1.5
SOLDERJUMPER_CLOSEDWIRE = smd 1.168 x 1.6: 1 -0.762,0; 2 0.762,0 | smd 0.635 x 0.203: WIRE 0,0
FIDUCIAL_1MM = smd 1.5 x 1.5: 1 0,0
QFN32 = smd 0.6 x 0.3: 1 -2.3,1.75; 2 -2.3,1.25; 3 -2.3,0.75; 4 -2.3,0.25; 5 -2.3,-0.25; 6 -2.3,-0.75; 7 -2.3,-1.25; 8 -2.3,-1.75; 17 2.3,-1.75; 18 2.3,-1.25; 19 2.3,-0.75; 20 2.3,-0.25; 21 2.3,0.25; 22 2.3,0.75; 23 2.3,1.25; 24 2.3,1.75 | smd 0.3 x 0.6: 9 -1.75,-2.3; 10 -1.25,-2.3; 11 -0.75,-2.3; 12 -0.25,-2.3; 13 0.25,-2.3; 14 0.75,-2.3; 15 1.25,-2.3; 16 1.75,-2.3; 25 1.75,2.3; 26 1.25,2.3; 27 0.75,2.3; 28 0.25,2.3; 29 -0.25,2.3; 30 -0.75,2.3; 31 -1.25,2.3; 32 -1.75,2.3 | smd 3.2 x 3.2: EXP 0,0
1X09 = drill 1.016 long: 1 -10.16,0; 2 -7.62,0; 3 -5.08,0; 4 -2.54,0; 5 0,0; 6 2.54,0; 7 5.08,0; 8 7.62,0; 9 10.16,0
1X05 = drill 1.016 long: 1 -5.08,0; 2 -2.54,0; 3 0,0; 4 2.54,0; 5 5.08,0
1X03 = drill 1.016 long: 1 -2.54,0; 2 0,0; 3 2.54,0
1X06_ROUND = drill 1 pad 1.676: 1 -6.35,0; 2 -3.81,0; 3 -1.27,0; 4 1.27,0; 5 3.81,0; 6 6.35,0
MCP1700T-3302E/TT = smd 0.5 x 1: GND -0.95,-1.25; VIN 0,1.25; VOUT 0.95,-1.25
CHIPLED_0603_NOOUTLINE = smd 0.8 x 0.8: A 0,-0.75; C 0,0.75
2X3_DFN = smd 0.3 x 0.75: 1 -0.75,-1.45; 2 -0.25,-1.45; 3 0.25,-1.45; 4 0.75,-1.45; 5 0.75,1.45; 6 0.25,1.45; 7 -0.25,1.45; 8 -0.75,1.45 | smd 1.45 x 1.75: 9 0,0
ESP32-WROOM-32-MODULE = smd 2 x 0.9: 1 -8.5,5.26; 2 -8.5,3.99; 3 -8.5,2.72; 4 -8.5,1.45; 5 -8.5,0.18; 6 -8.5,-1.09; 7 -8.5,-2.36; 8 -8.5,-3.63; 9 -8.5,-4.9; 10 -8.5,-6.17; 11 -8.5,-7.44; 12 -8.5,-8.71; 13 -8.5,-9.98; 14 -8.5,-11.25; 25 8.5,-11.25; 26 8.5,-9.98; 27 8.5,-8.71; 28 8.5,-7.44; 29 8.5,-6.17; 30 8.5,-4.9; 31 8.5,-3.63; 32 8.5,-2.36; 33 8.5,-1.09; 34 8.5,0.18; 35 8.5,1.45; 36 8.5,2.72; 37 8.5,3.99; 38 8.5,5.26 | smd 0.9 x 2: 15 -5.715,-12.25; 16 -4.445,-12.25; 17 -3.175,-12.25; 18 -1.905,-12.25; 19 -0.635,-12.25; 20 0.635,-12.25; 21 1.905,-12.25; 22 3.175,-12.25; 23 4.445,-12.25; 24 5.715,-12.25 | smd 5 x 5: GND 0,0
SO-8 = smd 0.559 x 1.194: 1 -1.905,-2.527; 2 -0.635,-2.527; 3 0.635,-2.527; 4 1.905,-2.527; 5 1.905,2.527; 6 0.635,2.527; 7 -0.635,2.527; 8 -1.905,2.527
1X08_OVAL = drill 1 long: 1 -8.89,0; 2 -6.35,0; 3 -3.81,0; 4 -1.27,0; 5 1.27,0; 6 3.81,0; 7 6.35,0; 8 8.89,0
1X01_ROUND = drill 1 pad 1.676: 1 0,0
LRTB_R48G = smd 0.45 x 0.45: 1 0.425,0.425; 2 0.425,-0.425; 3 -0.425,-0.425; 4 -0.425,0.425
SPDT_SMT_SSSS811101 = smd 0.7 x 1.5: A -2.25,1.75; B 0.75,1.75; C 2.25,1.75 | smd 1 x 0.8: SUP1 -3.65,1.1; SUP2 -3.65,-1.1; SUP3 3.65,1.1; SUP4 3.65,-1.1 | hole 0.9: -1.5,0; 1.5,0
USB_MICROB_PACKAGE = smd 0.4 x 1.35: 1 -1.3,1.47; 2 -0.64,1.47; 3 0,1.47; 4 0.66,1.47; 5 1.3,1.47 | smd 2.1 x 1.6: 6 -3.1,1.35; 11 3.1,1.35 | smd 1.8 x 1.9: 7 -4,-1.2; 10 4,-1.2 | smd 1.9 x 1.9: 8 -1.2,-1.2; 9 1.2,-1.2
1X04_ROUND = drill 1 pad 1.676: 1 -3.81,0; 2 -1.27,0; 3 1.27,0; 4 3.81,0

### Placement (x,y rotation side)
BOOT  37.34,44.96 270 top
C1  23.37,15.49 180 top
C2  22.86,17.53 90 top
C3  23.37,14.48 180 top
C4  15.49,14.86 0 top
C5  17.65,14.86 0 top
C6  22.35,28.57 90 top
C7  11.18,64.77 270 top
C8  9.91,64.77 270 top
C9  10.67,62.74 0 top
C10  29.21,17.02 90 top
C11  32,19.05 90 top
C12  25.91,24.64 0 top
C13  25.91,23.11 0 top
C14  23.5,28.57 90 top
C15  25.53,30.86 0 top
CN_LIPO  19.05,7.24 180 top
DTR  32,30.73 270 bottom
FB1  32.77,15.49 0 top
FB2  34.54,10.16 90 top
FID1  4.57,3.05 0 top
FID2  4.57,78.49 0 top
FID3  38.86,78.49 0 top
IC1  29.97,22.86 0 top
JP1  5.84,56.9 90 top
JP3  36.32,54.36 270 top
JP4  36.32,64.52 270 top
JTAG/HSPI  22.35,39.12 0 top
LDO1  25.15,16.76 180 top
LDO2  25.53,28.57 180 top
LED_CHG  19.05,23.11 180 top
LED_OK  17.78,23.11 0 top
LED_RX  35.43,26.42 180 top
LED_TX  34.04,26.42 180 top
LIPO1  16.38,17.78 0 top
MOD1  21.73,59.89 0 top
PCHAN1  28.45,11.94 180 top
PCHAN2  22.35,22.99 0 top
POWER  5.84,32.77 90 top
PROG  5.84,21.34 0 top
R1  18.03,20.7 270 top
R2  18.54,19.3 180 top
R4  16.13,20.83 0 top
R6  10.67,61.85 180 top
R7  21.08,42.16 90 top
R8  23.62,42.16 90 top
R9  26.16,42.16 90 top
R10  28.7,42.16 90 top
R11  29.21,19.05 90 top
R12  34.54,23.88 0 top
R13  34.54,22.86 0 top
R14  17.4,42.16 90 top
R15  16.38,42.16 90 top
R16  15.37,42.16 90 top
RGB1  17.02,44.07 0 top
RTS  29.08,30.86 90 bottom
SJ1  32.51,36.32 180 bottom
SJ2  32.51,39.62 180 bottom
STAT  5.84,18.8 0 top
SWPOWER  37.08,14.73 90 top
U$14  33.4,5.97 0 top
UART  36.32,35.31 90 top

### Tracks (layer width: path | path; a pad name or v marks a point on that pad's centre or on a via)
3.3V  (via drill 0.25 pad 0.51)
  Top 0.254: IC1.16 31.72,19.84 C11.2 v32.87,19.56 | 24.2,17.21 LDO1.VOUT | 24.2,17.21 24,17.02 C2.1 22.35,17.02 22.1,17.27 22.1,19.05 22.99,19.94 PCHAN2.3 | v27.3,17.02 24.39,17.02 24.2,17.21 | R6.2 v9.4,61.85 | v11.3,46.1 12.06,45.34 16.89,45.34 17.44,44.79 RGB1.1 18.24,44.49 18.54,44.2 JTAG/HSPI.2 v18.54,29.84 18.56,29.82 LDO2.VOUT | UART.2 34.8,32.51 34.8,30.86 | 34.8,30.86 37.59,28.07 v37.59,21.08 | LED_RX.A LED_TX.A 34.16,27.29 v34.16,28.45 | v33.91,30.35 34.42,30.86 34.8,30.86 | C15.1 24.58,30.42 LDO2.VOUT | IC1.1 27.08,24.61 26.95,24.74 26.95,26.44 27.69,27.18 27.69,28.19 27.43,28.45 25.15,28.45 24.58,29.02 LDO2.VOUT | C8.2 10.16,64.01 C7.2 11.31,63.88 MOD1.2 v15.11,63.88
  Bottom 0.254: v9.4,61.85 9.4,60.71 | 9.4,60.71 9.4,48.01 v11.3,46.1 | v37.59,21.08 36.07,19.56 v32.87,19.56 32.87,17.55 34.04,16.38 34.04,11.43 33.66,11.05 33.15,11.05 31.75,12.45 31.75,14.61 31.11,15.24 29.08,15.24 v27.3,17.02 22.61,17.02 18.54,21.08 v18.54,29.84 | v34.16,28.45 34.16,30.1 v33.91,30.35 | v15.11,63.88 13.59,63.88 12.83,63.12 12.83,62.48 12.06,61.72 11.43,61.72 10.41,60.71 9.4,60.71
_3.3V
  Top 0.254: POWER.6 POWER.5 9.53,34.04 10.41,33.15 10.41,28.57 11.18,27.81 21.34,27.81 22.86,26.29 22.86,25.64 PCHAN2.6 22.99,24.77 23.37,24.38 24,24.38 24.26,24.64 PCHAN2.5
_VBAT  (via drill 0.25 pad 0.51)
  Top 0.254: PCHAN1.6 27.81,8.26 27.69,8.13 26.67,8.13 | 26.67,8.13 25.65,8.13 25.4,8.38 21.34,8.38 20.83,7.87 v18.67,7.87 18.67,7.89 18.05,8.51 CN_LIPO.2 18.05,13.57 17.14,14.48 C5.1 17.13,14.87 LIPO1.4 LIPO1.3 | 26.67,8.13 26.67,9.28 PCHAN1.5 | v14.1,17.53 13.21,18.41 10.29,18.41 8.76,19.94 8.76,28.96 POWER.3
  Bottom 0.254: v18.67,7.87 14.1,12.45 v14.1,17.53
_VIN
  Top 0.254: PCHAN2.7 21.72,24.38 21.59,24.26 20.57,24.26 20.57,25.39 PCHAN2.8 20.45,26.67 20.07,27.05 10.92,27.05 9.65,28.32 9.65,30.86 9.02,31.5 POWER.4
_VUSB  (via drill 0.25 pad 0.51)
  Top 0.254: U$14.1 32.1,8.79 31.48,9.41 PCHAN1.8 30.35,10.29 29.97,10.67 29.46,10.67 | 29.46,10.67 29.08,10.29 PCHAN1.7 | 29.46,10.67 29.46,10.92 28.96,11.43 v24,11.43 | v15.11,12.83 13.97,13.97 13.97,16.26 12.45,17.78 10.03,17.78 8.13,19.68 8.13,26.42 POWER.2
  Bottom 0.254: v24,11.43 16.51,11.43 v15.11,12.83
BOOT/DTR  (via drill 0.25 pad 0.51)
  Top 0.254: MOD1.25 30.48,48.39 31.5,48.39 33.23,46.66 | 33.23,46.66 BOOT.1 | 33.23,46.66 33.23,44.91 31.75,43.43 31.75,36.96 31.11,36.32 31.11,33.91 30.73,33.53 v30.73,32.38 | v29.72,28.57 28.72,27.58 IC1.31
  Bottom 0.152: DTR.2 DTR.1
  Bottom 0.254: v29.72,28.57 31.11,28.57 32,29.46 DTR.2 | DTR.1 31.11,32.38 v30.73,32.38
EN/RTS  (via drill 0.25 pad 0.51)
  Top 0.254: R6.1 C9.2 11.31,62.61 MOD1.3 v14.85,62.61 v14.86,62.61 | v29.84,42.29 30.86,41.27 30.86,37.34 30.35,36.83 30.35,34.8 v28.19,32.64 | v28.22,28.86 IC1.32
  Bottom 0.152: RTS.1 RTS.2
  Bottom 0.254: v14.86,62.61 15.75,61.72 15.75,53.21 16.64,52.32 21.72,52.32 29.84,44.2 v29.84,42.29 | v28.22,28.86 28.73,28.86 29.08,29.21 RTS.1 | RTS.2 28.96,31.62 28.19,32.38 v28.19,32.64
GND_UNMASKED  (via drill 0.25 pad 0.51, 0.51 pad 1.27)
  Top 0.254: IC1.20 v33.13,22.61 | v36.2,21.08 v36.2,22.61 36.22,22.63 v36.22,24.64 | IC1.17 33.12,21.11 v33.15,21.08 33.53,20.7 33.53,19.18 32.89,18.54 C11.1 | IC1.24 33.12,24.61 v33.15,24.64 33.15,25.4 32.64,25.91 31.37,25.91 31.22,25.76 IC1.26 | IC1.4 27.17,23.11 27.05,22.99 27.05,22.73 26.8,22.48 | 26.8,22.48 25.65,22.48 25.4,22.73 C13.1 C12.1 25.38,24.66 v25.38,25.91 | 29.08,12.83 PCHAN1.2 29.08,15.62 | PCHAN1.4 26.54,13.21 | 26.54,13.21 26.92,12.83 29.08,12.83 | CN_LIPO.1 20.32,11.21 20.32,12.57 | 20.32,12.57 20.32,12.95 22.86,12.95 | 22.86,12.95 25.02,12.95 25.27,13.21 26.54,13.21 | FB2.2 34.29,11.18 34.29,11.68 34.04,11.94 34.04,12.7 33.53,13.21 32,13.21 31.62,12.83 29.08,12.83 | 29.08,15.62 29.08,16.38 | 29.08,16.38 C10.1 | v29.97,16 29.72,15.75 29.21,15.75 29.08,15.62 | 26.8,22.48 26.8,20.07 27.3,19.56 | 29.08,16.38 28.7,16.38 28.45,16.64 28.45,18.41 27.3,19.56 | C1.2 C3.2 22.86,12.95 | C2.2 22.86,18.92 22.99,19.05 24.51,19.05 | 27.3,19.56 26.8,19.05 26.04,19.05 | 24.51,19.05 26.04,19.05 | LDO1.GND 26.1,18.99 26.04,19.05 | C4.2 16,14.1 v16.26,13.84 | 20.32,12.57 19.94,12.95 v19.94,13.72 19.94,14.48 19.56,14.86 C5.2 18.16,16.76 17.4,17.53 16.64,17.53 16.51,17.65 | LIPO1.9 16.51,17.65 | 16.51,17.65 16.63,17.78 LIPO1.6 R4.2 16.64,23.37 17.13,23.86 LED_OK.C | JTAG/HSPI.1 POWER.7 | C9.1 v9.4,62.74 | v9.14,65.28 C8.1 10.16,65.53 C7.1 11.56,65.15 MOD1.1 21.34,65.15 21.72,64.77 21.72,64.64 | PCHAN2.2 21.72,21.34 21.97,21.59 24.13,21.59 24.26,21.46 PCHAN2.4 24.51,20.21 24.51,19.05 | MOD1.15 15.62,47.24 v13.59,47.24 10.29,47.24 8.26,45.21 8.26,42.04 7.87,41.66 POWER.8 | 21.72,64.64 21.72,60.83 21.73,60.83 MOD1.GND
  Top 0.254: MOD1.38 22.22,65.15 21.72,64.64 | MOD1.GND 21.73,51.95 v21.34,51.56 | BOOT.2 v37.34,42.29 | C14.2 C6.2 v21.08,29.08 | LDO2.GND 26.48,30.42 C15.2 26.04,31.37 25.4,32 22.48,32 v21.08,30.61 | MOD1.GND 21.15,59.89 v20.19,58.93
  Bottom 0.254: v33.13,22.61 v36.2,22.61 | v36.2,21.08 v33.15,21.08 32.26,20.19 30.73,20.19 29.97,19.43 v29.97,16 | v33.15,24.64 v36.22,24.64 36.32,24.74 UART.1 35.18,31.5 34.8,31.88 34.8,40.89 35.56,41.66 36.7,41.66 v37.34,42.29 | v16.26,13.84 17.02,13.08 19.3,13.08 v19.94,13.72 19.94,18.16 17.27,20.83 12.83,20.83 9.78,23.88 8.38,23.88 | POWER.1 8.38,23.88 | POWER.8 POWER.7 7.37,39.12 8.38,38.1 8.38,23.88 | v9.4,62.74 9.14,62.99 v9.14,65.28 | v21.34,51.56 16.13,51.56 13.59,49.02 v13.59,47.24 | v21.08,30.61 v21.08,29.08 21.08,28.07 21.84,27.3 23.98,27.3 v25.38,25.91 | v20.19,60.83 v20.19,58.93 v21.97,58.93 v21.97,60.83
  pour Bottom (isolate 0.508): 4.06,3.56 38.61,3.56 38.61,65.91 4.06,65.91
  pour Top (isolate 0.508): 4.06,3.56 38.61,3.56 38.61,65.91 4.06,65.91
IO5
  Top 0.254: MOD1.29 32.63,53.72 33.27,54.36 JP3.3
IO16
  Top 0.254: MOD1.27 31.75,51.18 33.66,49.28 JP3.5
IO17
  Top 0.254: MOD1.28 32.39,52.45 33.02,51.82 JP3.4
IO18
  Top 0.254: MOD1.30 32,54.99 33.91,56.9 JP3.2
IO19
  Top 0.254: MOD1.31 31.75,56.26 34.92,59.44 JP3.1
IO21
  Top 0.254: MOD1.33 31.87,58.8 35.05,61.98 JP4.3
IO22
  Top 0.254: MOD1.36 31.87,62.61 33.78,64.52 JP4.2
IO23
  Top 0.254: MOD1.37 31.49,63.88 34.67,67.06 JP4.1
IO25/DAC_1
  Top 0.254: MOD1.10 10.79,53.72 8.89,51.82 JP1.3
IO26/DAC_2
  Top 0.254: MOD1.11 11.3,52.45 8.13,49.28 JP1.2
IO27/BLUE  (via drill 0.25 pad 0.51)
  Top 0.254: R16.1 15.37,41.02 v15.24,40.89 | MOD1.12 11.3,51.18 8.38,48.26 8.38,47.24 7.87,46.74 JP1.1
  Bottom 0.254: v15.24,40.89 10.79,40.89 7.87,43.81 7.87,46.35 7.49,46.74 JP1.1
IO32/RED  (via drill 0.25 pad 0.51)
  Top 0.254: R14.1 17.4,41.02 v17.27,40.89 | MOD1.8 9.28,56.26 8.64,56.9 JP1.5
  Bottom 0.254: v17.27,40.89 17.27,41.66 16.51,42.42 11.43,42.42 9.14,44.7 9.14,47.12 8.64,47.62 8.64,56.13 7.87,56.9 JP1.5
IO33/GREEN  (via drill 0.25 pad 0.51)
  Top 0.254: R15.1 16.38,41.02 v16.26,40.89 | MOD1.9 9.27,54.99 8.64,54.36 JP1.4
  Bottom 0.254: v16.26,40.89 16.26,41.4 16,41.66 11.05,41.66 8.51,44.2 8.51,46.86 7.87,47.5 7.87,53.98 7.49,54.36 JP1.4
IO34
  Top 0.254: MOD1.6 13.09,58.93 9.91,58.93 6.86,61.98 JP1.7
IO35
  Top 0.254: MOD1.7 10.04,57.53 8.13,59.44 JP1.6
MTCK/HSPID(MOSI)
  Top 0.254: R9.1 JTAG/HSPI.5
MTDI/HSPIQ(MISO)
  Top 0.254: R8.1 JTAG/HSPI.4
MTDI_  (via drill 0.25 pad 0.51)
  Top 0.254: MOD1.14 14.6,48.64 v14.73,48.77 | v23.62,43.94 R8.2
  Bottom 0.254: v14.73,48.77 16.51,50.55 21.08,50.55 23.62,48.01 v23.62,43.94
MTDO/HSPICS0(CS)
  Top 0.254: R10.1 JTAG/HSPI.6
MTMS/HSPICLK
  Top 0.254: R7.1 JTAG/HSPI.3
N$2
  Top 0.254: U$14.5 34.7,9.24 FB2.1
N$4
  Top 0.254: R12.2 35.05,24.38 34.8,24.64 34.29,24.64 34.04,24.89 LED_TX.C
N$5
  Top 0.254: R13.2 35.18,22.99 35.56,22.99 35.69,23.11 35.69,24.52 35.43,24.78 LED_RX.C
N$6
  Top 0.254: R16.2 15.37,44.07 15.79,44.49 RGB1.4
N$7  (via drill 0.25 pad 0.51)
  Top 0.254: MOD1.13 20.71,49.91 v20.83,49.78 | v21.08,43.94 R7.2
  Bottom 0.254: v20.83,49.78 20.83,44.2 v21.08,43.94
N$8
  Top 0.254: RGB1.3 16.38,43.43 R15.2
N$9
  Top 0.254: LED_OK.A 17.78,21.46 R1.1
N$10
  Top 0.254: R2.1 LED_CHG.C
N$11
  Top 0.254: R14.2 17.44,42.72 RGB1.2
N$18
  Top 0.254: MOD1.16 17.28,45.97 17.53,45.72 25.4,45.72 26.16,44.96 R9.2
N$19
  Top 0.254: MOD1.23 26.17,45.97 28.7,43.43 R10.2
PROG  (via drill 0.25 pad 0.51)
  Top 0.254: LIPO1.8 15.63,20.05 v15.62,20.07 R4.1
  Bottom 0.254: PROG.1 11.3,21.34 12.57,20.07 v15.62,20.07
PWREN#
  Top 0.254: IC1.11 29.22,19.57 R11.2
RX  (via drill 0.25 pad 0.51)
  Top 0.254: UART.3 35.31,36.58 v33.78,35.05 32.51,36.32 v32.51,42.29 | v32.26,60.45 31.87,60.07 MOD1.34
  Bottom 0.254: v33.78,35.05 33.27,35.56 SJ1.2 | v32.51,42.29 32.51,60.2 v32.26,60.45
RXLED#
  Top 0.254: IC1.21 32.88,23.11 32.91,23.14 33.76,23.14 R13.1
SEN_VN
  Top 0.254: MOD1.5 13.09,60.2 9.4,60.2 7.87,61.72 7.87,64.52 JP1.8
SEN_VP
  Top 0.254: MOD1.4 13.1,61.21 9.14,61.21 8.61,61.75 8.61,65.5 8.64,65.52 8.64,66.04 7.62,67.06 JP1.9
STAT  (via drill 0.25 pad 0.51)
  Top 0.254: LIPO1.5 17.21,19.3 R2.2 | R2.2 R1.2 | R2.2 v18.03,18.41
  Bottom 0.254: v18.03,18.41 17.65,18.8 STAT.1
TX  (via drill 0.25 pad 0.51)
  Top 0.254: UART.4 35.56,38.35 v33.78,38.35 | v32.77,61.72 32.38,61.34 MOD1.35
  Bottom 0.254: v33.78,38.35 33.27,38.86 SJ2.2 33.27,61.21 v32.77,61.72
TXLED#/12MHZ_OUT
  Top 0.254: IC1.22 33.77,23.61 R12.1
UART_RX  (via drill 0.25 pad 0.51)
  Top 0.254: IC1.2 26.9,24.11 v26.67,23.88 | v29.97,37.85 29.46,37.34 29.46,35.18 27.3,33.02 v27.3,30.86
  Bottom 0.254: v26.67,23.88 26.16,24.38 26.16,29.72 v27.3,30.86 | SJ2.1 v29.97,37.85
UART_TX  (via drill 0.25 pad 0.51)
  Top 0.254: IC1.30 29.22,27.04 31.75,29.57 v31.75,34.8
  Bottom 0.254: v31.75,34.8 SJ1.1
USB+  (via drill 0.25 pad 0.51)
  Top 0.254: U$14.3 v33.4,11.81 | v31.24,18.41 30.48,19.18 30.48,19.68 30.73,19.94 30.73,20.55 IC1.14
  Bottom 0.254: v33.4,11.81 33.4,16.26 v31.24,18.41
USB-  (via drill 0.25 pad 0.51)
  Top 0.254: IC1.15 31.22,19.45 v31.24,19.43 | v32.74,12.57 32.76,12.55 U$14.2
  Bottom 0.254: v31.24,19.43 31.11,19.43 30.58,18.9 30.58,18.19 32.74,16.04 v32.74,12.57
VBAT
  Top 0.254: PCHAN1.3 27.81,15.49 26.92,16.38 25.78,16.38 25.15,15.75 LDO1.VIN 23.9,15.51 | 23.9,15.51 C1.1 C3.1 | PCHAN2.1 20.45,17.53 21.72,16.26 23.75,16.26 23.9,16.11 23.9,15.51
VPWR  (via drill 0.25 pad 0.51)
  Top 0.254: R11.1 30.23,18.54 31.79,16.98 SWPOWER.C 35.18,17.14 35.18,19.05 35.43,19.3 36.45,19.3 36.83,19.68 v36.83,21.84 36.83,27.81 35.18,29.46 33.53,29.46 32.26,28.19 v32.26,26.67 | v33.15,21.84 32.92,22.07 32.91,22.07 32.87,22.11 IC1.19 | C13.2 26.04,23.5 26.04,24.26 C12.2 26.42,27.18 | 26.42,27.18 26.92,27.69 v27.05,27.69 | C6.1 C14.1 23.88,28.07 24.62,27.32 LDO2.VIN 26.27,27.32 26.42,27.18
  Bottom 0.254: v33.15,21.84 v36.83,21.84 | v27.05,27.69 28.45,27.69 30.35,25.78 31.88,25.78 32.26,26.16 v32.26,26.67
VUSB
  Top 0.254: PCHAN1.1 30.35,15.24 30.61,15.49 31.11,15.49 | 31.11,15.49 FB1.1 | C10.2 30.1,17.53 31.11,16.51 31.11,15.49
VUSB_CHG_LIPO  (via drill 0.25 pad 0.51)
  Top 0.254: LIPO1.2 LIPO1.1 15.63,15.63 15.49,15.49 15.24,15.49 14.99,15.24 | LED_CHG.A 19.05,24.64 18.8,24.89 17.02,24.89 15.88,23.75 15.88,22.23 14.99,21.34 14.99,15.24 | 14.99,15.24 C4.1 14.99,13.97 v16.26,12.7 | SWPOWER.A 35.18,12.64 v35.18,13.34
  Bottom 0.254: v35.18,13.34 35.18,11.18 34.04,10.03 31.88,10.03 29.59,12.32 16.64,12.32 v16.26,12.7
VUSB_FILTERED
  Top 0.254: FB1.2 35.32,15.49 SWPOWER.B

### Text on the board
tPlace: 2kOhm = 500mA | LiPO mA | ON | + | - | OFF | CHARGE
bPlace: HACKER.HOUSE | VIN 6V MAX | Designed by / Femtoduino / for / Hacker House | 2.0.2 | POWER | LIPO / 6V MAX
tNames: SVP | IO23 | SVN | IO22 | IO34 | IO21 | IO35 | IO19 | IO32/R | IO18 | IO33/G | IO5 | IO25 | IO17 | IO26 | IO16 | IO27/B | BOOT | IO14 | IO12 | IO13 | IO15 | GND | GND | TX | GND | 3.3V | MTMS/CLK | MTDI/MISO | MTCK/MOSI | MTDO/CS | 3.3V IN | RX | 3.3V IN | 3.3V | VIN | GND | VBAT | VUSB | GND
bNames: URX/TX | UTX/RX